# EasyEDA Pro project ProPrj_遥控板子_2025-03-31.epro

# Schematic Schematic1

## Sheets
1 P1: Board Name: Board1; Create Date: 2024-12-14; Page Name: P1; Project Name: 遥控板子; Schematic Name: Schematic1; Update Date: 2024-12-17; Company: 嘉立创EDA; Page Size: A4; Version: V1.0
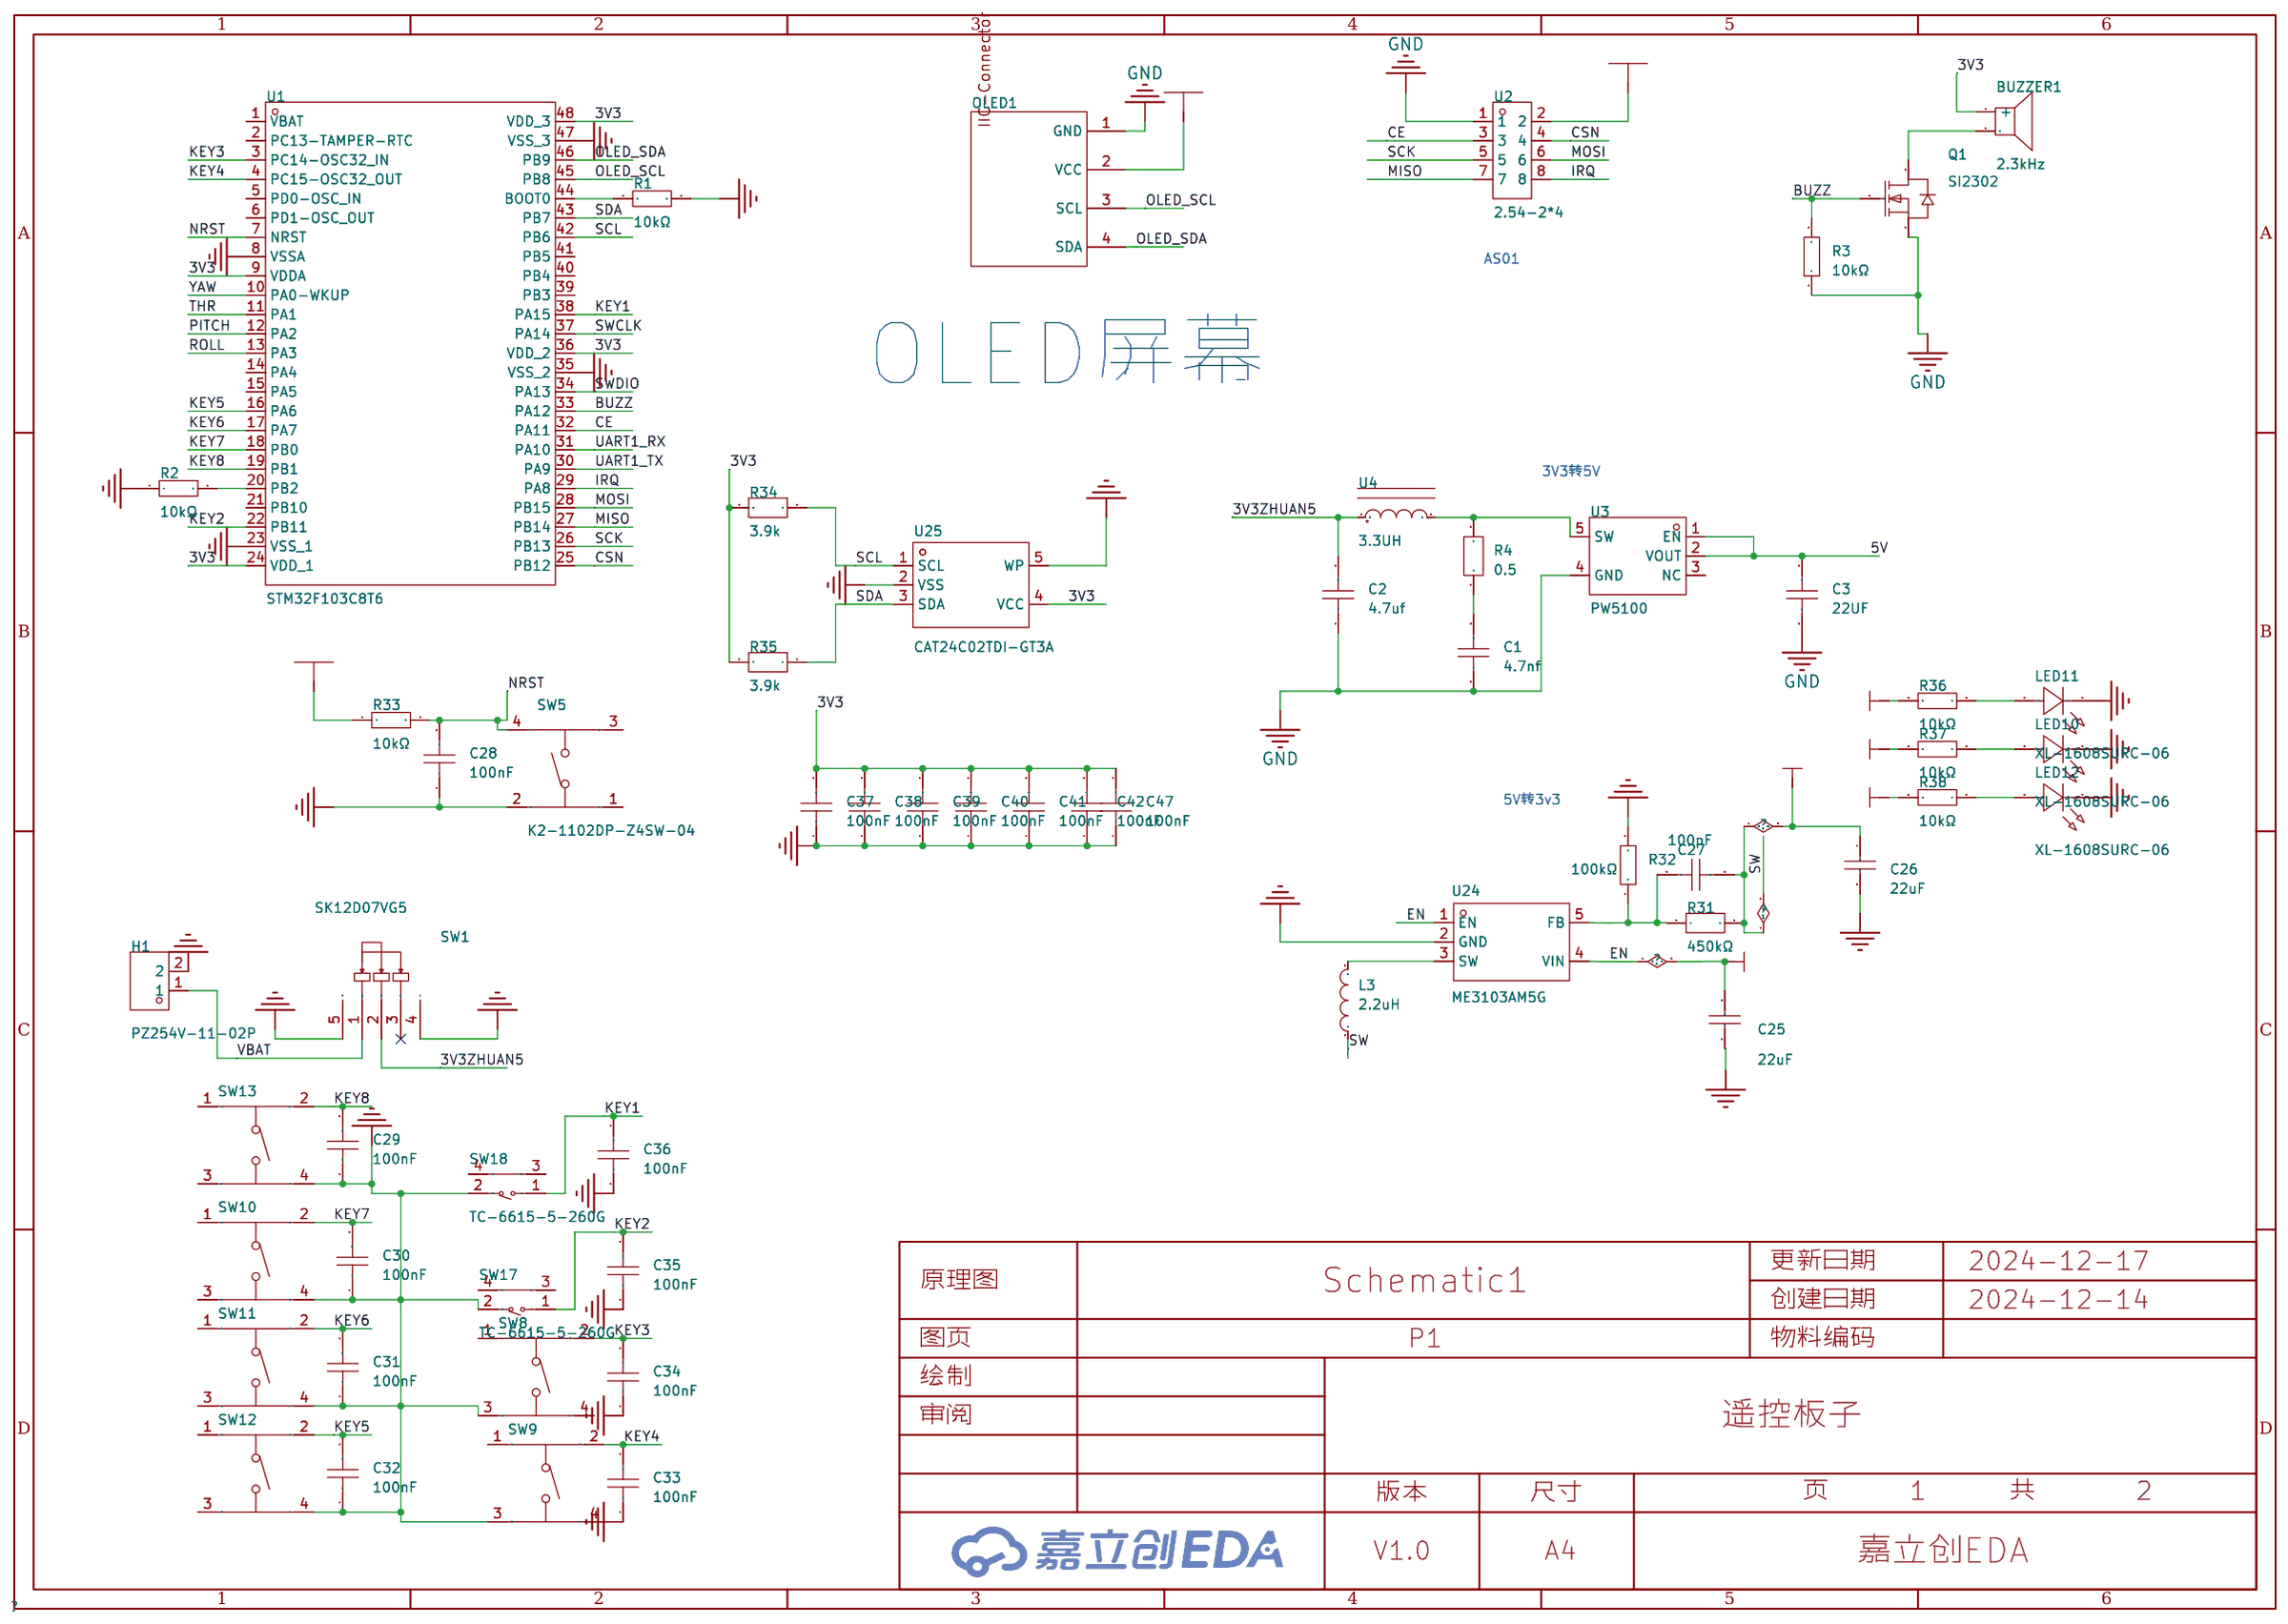
[diagram p0: P1]
2 P2: Create Date: 2024-12-16; Page Name: P2; Update Date: 2024-12-16
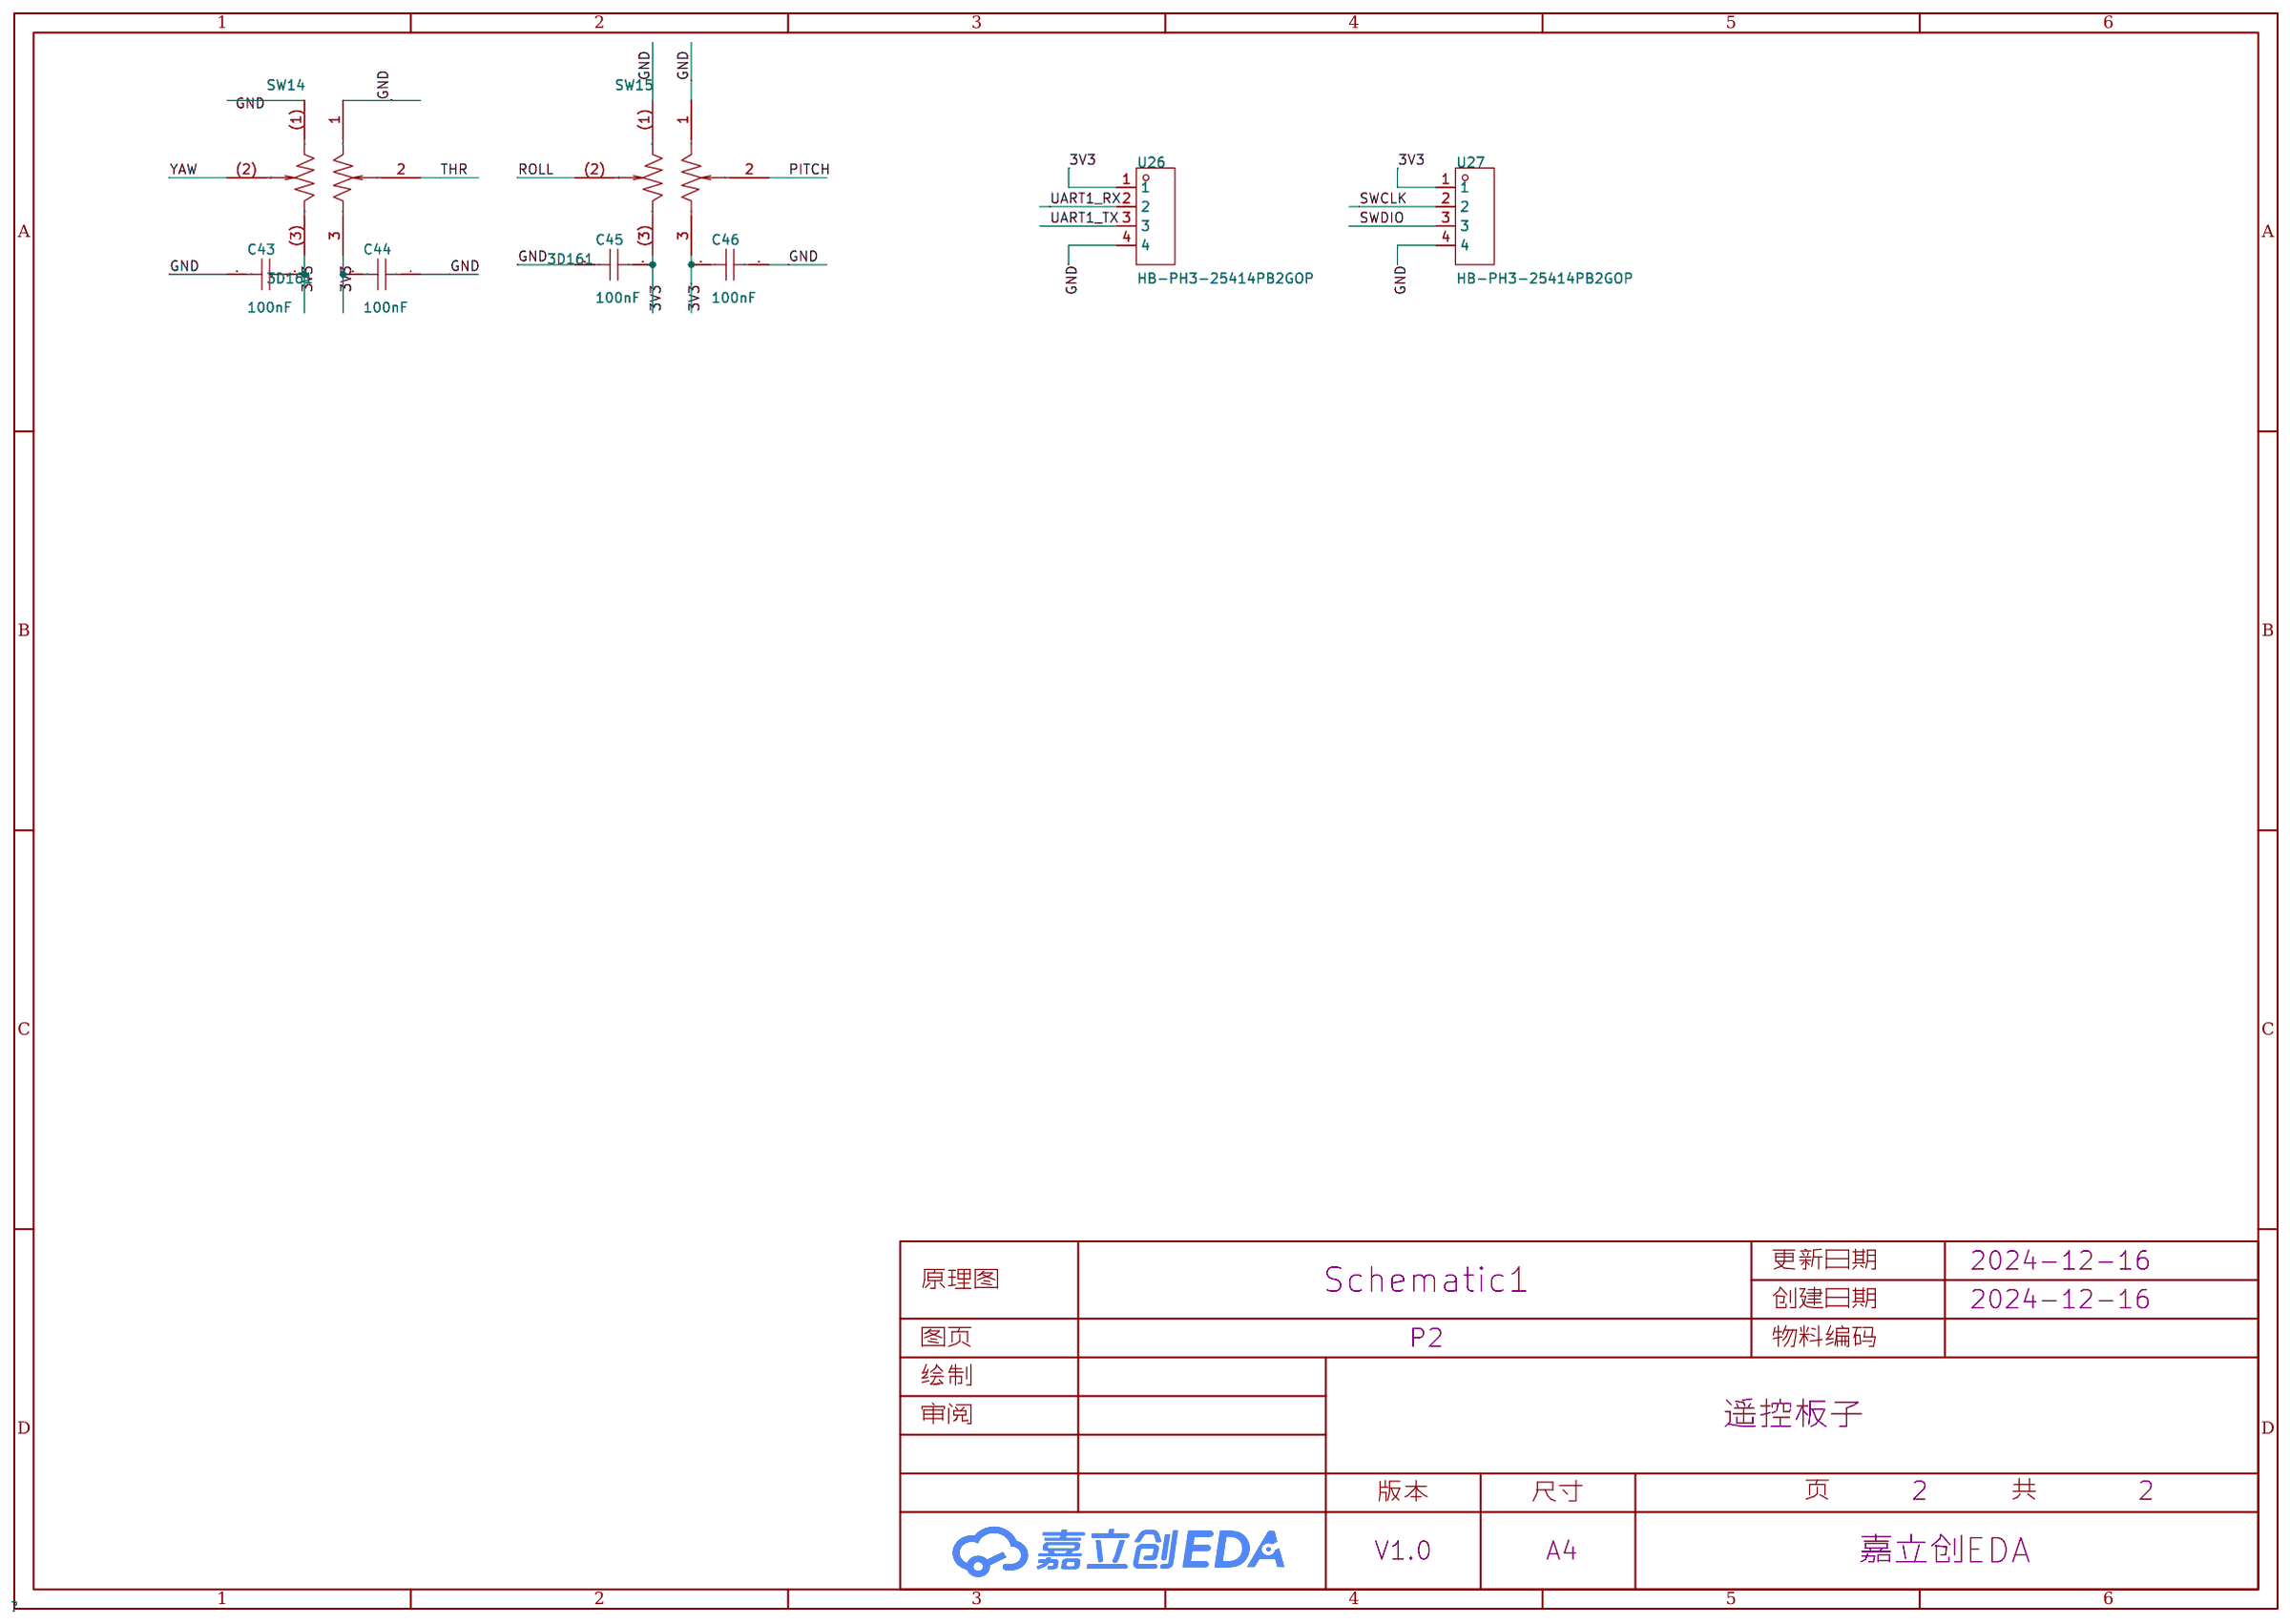
[diagram p1: P2]

## Parts
sheet P1
BUZZER1  2.3kHz  [BUZ-TH_BD12.0-P7.60-D0.6-FD]
C1  4.7nf  [C0603]
C2  4.7uf  [C0603]
C3  22UF  [C1206]
C25  22uF  [C1206]
C26  22uF  [C1206]
C27  100pF  [C0603]
C28  100nF  [C0603]
C29  100nF  [C0603]
C30  100nF  [C0603]
C31  100nF  [C0603]
C32  100nF  [C0603]
C33  100nF  [C0603]
C34  100nF  [C0603]
C35  100nF  [C0603]
C36  100nF  [C0603]
C37  100nF  [C0603]
C38  100nF  [C0603]
C39  100nF  [C0603]
C40  100nF  [C0603]
C41  100nF  [C0603]
C42  100nF  [C0603]
C47  100nF  [C0603]
H1  PZ254V-11-02P  [HDR-TH_2P-P2.54-V-M]
L3  2.2uH  [IND-SMD_L2.5-W2.0_MHCD252012A]
LED10  XL-1608SURC-06  [LED0603-RD_RED]
LED11  XL-1608SURC-06  [LED0603-RD_RED]
LED12  XL-1608SURC-06  [LED0603-RD_RED]
OLED1  -  [0.96OLED_4P]
Q1  SI2302  [SOT-23-3_L2.9-W1.3-P1.90-LS2.4-BR]
R1  10kΩ  [R0805]
R2  10kΩ  [R0805]
R3  10kΩ  [R0805]
R4  0.5  [R0603]
R31  450kΩ  [R0402]
R32  100kΩ  [R0603]
R33  10kΩ  [R0805]
R34  0.5  [R0603]
R35  0.5  [R0603]
R36  10kΩ  [R0805]
R37  10kΩ  [R0805]
R38  10kΩ  [R0805]
SW1  SK12D07VG5  [SW-TH_SK12D07VG5]
SW5  K2-1102DP-Z4SW-04  [SW-TH_4P-L6.0-W6.0-P4.50-LS6.5]
SW8  K2-1102DP-Z4SW-04  [SW-TH_4P-L6.0-W6.0-P4.50-LS6.5]
SW9  K2-1102DP-Z4SW-04  [SW-TH_4P-L6.0-W6.0-P4.50-LS6.5]
SW10  K2-1102DP-Z4SW-04  [SW-TH_4P-L6.0-W6.0-P4.50-LS6.5]
SW11  K2-1102DP-Z4SW-04  [SW-TH_4P-L6.0-W6.0-P4.50-LS6.5]
SW12  K2-1102DP-Z4SW-04  [SW-TH_4P-L6.0-W6.0-P4.50-LS6.5]
SW13  K2-1102DP-Z4SW-04  [SW-TH_4P-L6.0-W6.0-P4.50-LS6.5]
SW17  TC-6615-5-260G  [SW-TH_4P-L7.5-W5.0-P4.50]
SW18  TC-6615-5-260G  [SW-TH_4P-L7.5-W5.0-P4.50]
U1  STM32F103C8T6  [LQFP-48_L7.0-W7.0-P0.50-LS9.0-BL]
U2  2.54-2*4  [HDR-TH_8P-P2.54-V-F-R2-C4-S2.54]
U3  PW5100  [SOT-23-5_L3.0-W1.7-P0.95-LS2.8-BR]
U4  4.7uH  [IND-SMD_L7.0-W6.6]
U24  ME3103AM5G  [SOT-23-5_L3.0-W1.7-P0.95-LS2.8-BR]
U25  CAT24C02TDI-GT3A  [TSOT-23-5_L2.9-W1.6-P0.95-LS2.8-BR]
sheet P2
C43  100nF  [C0603]
C44  100nF  [C0603]
C45  100nF  [C0603]
C46  100nF  [C0603]
SW14  3D161  [SW-TH_3D161]
SW15  3D161  [SW-TH_3D161]
U26  HB-PH3-25414PB2GOP  [HDR-TH_4P-P2.54-V-M]
U27  HB-PH3-25414PB2GOP  [HDR-TH_4P-P2.54-V-M]

## Library data of the parts
BUZZER1 = TMB12A03: 驱动方式:有源(内含驱动线路);构造类型:电磁式;频率:2.3kHz;声压(SPL):85dB;; Supplier Part: C96222; Manufacturer: 华能; Supplier Footprint: 插件,D=12mm; JLCPCB Part Class: 扩展库; Datasheet: https://atta.szlcsc.com/upload/public/pdf/source/20211202/CAFCFF4D10B388AA00F36865319470DA.pdf; Supplier: LCSC; Oscillator Circuit: 有源(内含驱动线路); Technology Type: 电磁式; Operating Voltage: 1.5V~4V; Sound Pressure Level (SPL): 85dB; Diameter (φD): 12mm; Height: 9.8mm
C1 C2 C28-C47 = CGA0603X7R104K500JT: 容值:100nF;精度:±10%;额定电压:50V;材质(温度系数):X7R;; LCSC Part Name: 100nF ±10% 50V; Supplier Part: C6119867; Manufacturer: HRE(芯声); Supplier Footprint: 0603; JLCPCB Part Class: 扩展库; Supplier: LCSC; Tolerance: ±10%; Voltage Rated: 50V; Temperature Coefficient: X7R
C3 = HGC1206R5106K500NSPJ: 容值:10uF;精度:±10%;额定电压:50V;材质(温度系数):X5R;; LCSC Part Name: 10uF ±10% 50V; Supplier Part: C7432781; Manufacturer: Chinocera(华瓷); Supplier Footprint: 1206; JLCPCB Part Class: 扩展库; Datasheet: https://atta.szlcsc.com/upload/public/pdf/source/20240320/FAC3FEC40A78BC5CCCE96C232A94D860.pdf; Supplier: LCSC; Tolerance: ±10%; Voltage Rated: 50V; Temperature Coefficient: X5R
C25 C26 = CL31A226KAHNNNE: 容值:22uF;精度:±10%;额定电压:25V;材质(温度系数):X5R;; LCSC Part Name: 22uF ±10% 25V; Supplier Part: C12891; Manufacturer: SAMSUNG(三星); Supplier Footprint: 1206; JLCPCB Part Class: 基础库; Datasheet: https://atta.szlcsc.com/upload/public/pdf/source/20160218/1457707763339.pdf; Supplier: LCSC; Tolerance: ±10%; Voltage Rated: 25V; Temperature Coefficient: X5R
C27 = CC0603JRNPO9BN101: 容值:100pF;精度:±5%;额定电压:50V;材质(温度系数):NP0;; LCSC Part Name: 100pF ±5% 50V; Supplier Part: C14665; Manufacturer: YAGEO(国巨); Supplier Footprint: 0603; JLCPCB Part Class: 扩展库; Datasheet: https://atta.szlcsc.com/upload/public/pdf/source/20181008/C309499_21CC21451B82C39E3D92150FD6B30293.pdf; Supplier: LCSC; Tolerance: ±5%; Voltage Rated: 50V; Temperature Coefficient: NP0
H1 = PZ254V-11-02P: 插针结构:1x2P;间距:2.54mm;行距:-;圆针/方针:方针;安装类型:直插;排数:单排;总PIN位数:2P;额定电流:-;额定电压:-;配合针长度:6mm;塑高:2.5mm;端接针长度:3mm;触头材质:黄铜;触头镀层:-;工作温度范围:-40℃~+105℃;颜色:黑色;; LCSC Part Name: 间距:2.54mm 1x2P 直插 方针; Supplier Part: C492401; Manufacturer: XFCN(兴飞); Supplier Footprint: 插件,P=2.54mm; JLCPCB Part Class: 扩展库; Datasheet: https://atta.szlcsc.com/upload/public/pdf/source/20200309/C492401_A812433581A9B211A7FFA413ADDFF0E5.pdf; Supplier: LCSC; Pin Structure: 1x2P; Pitch: 2.54mm; Circluar Pins/Square Pins: 方针; Mounting Type: 直插; Number of Rows: 单排; Number of Pins: 2P; Length of Mating Pin: 6mm; Insulation Height: 2.5mm; Length of End Connection Pin: 3mm; Contact Material: 黄铜; Operating Temperature Range: -40℃~+105℃; Color: 黑色
L3 = BDCD002520102R2MS1: 电感值:2.2uH;精度:±20%;额定电流:1.4A;饱和电流(Isat):2.6A;; LCSC Part Name: 2.2uH ±20% 2.6A; Supplier Part: C2838385; Manufacturer: chilisin(奇力新); Supplier Footprint: 1008; JLCPCB Part Class: 扩展库; Datasheet: https://atta.szlcsc.com/upload/public/pdf/source/20210908/A593167DE07B217A909851FD79DFB804.pdf; Supplier: LCSC; Tolerance: ±20%; Rated Current: 1.4A; Saturation Current (Isat): 2.6A; DC Resistance (DCR): 130mΩ
LED10-LED12 = XL-1608SURC-06: 发光颜色:红色;功率:55mW;正向电流:25mA;主波长:617nm~621nm;透镜颜色:无色透明透镜;色温:-;发光角度:120°;载带方式:正贴;工作温度:-30℃~+85℃;; Supplier Part: C965799; Manufacturer: XINGLIGHT(成兴光); Supplier Footprint: 0603; JLCPCB Part Class: 扩展库; Datasheet: https://atta.szlcsc.com/upload/public/pdf/source/20221102/D860AFDD1CDB02C5A8064103A32707E2.pdf; Supplier: LCSC; Emitted Color: 红色; Power Dissipation: 55mW; Forward Current: 25mA; Dominant Wavelength: 617nm~621nm; Peak Wavelength: 623nm; Lens Color: 无色透明透镜; Viewing Angle: 120°; Mounting Sytle: 正贴; Operating Temperature: -30℃~+85℃
OLED1 = 0.96OLED_4P: LCSC Part Name: 0.96OLED_4P_MODULE_JX; Supplier Part: C9900004566; Manufacturer Part: 0.96OLED_4P_MODULE_JX; Supplier Footprint: THrough hole; JLCPCB Part Class: Extended Part; Supplier: LCSC
Q1 = SI2302_C2891732: 类型:1个N沟道;漏源电压(Vdss):20V;连续漏极电流(Id):3A;导通电阻(RDS(on)@Vgs,Id):50mΩ@4.5V,3A;功率(Pd):1W;阈值电压(Vgs(th)@Id):1V@250uA;; LCSC Part Name: N沟道,电流:3A,耐压:20V; Supplier Part: C2891732; Manufacturer: YONGYUTAI(永裕泰); Supplier Footprint: SOT-23; JLCPCB Part Class: 扩展库; Datasheet: https://atta.szlcsc.com/upload/public/pdf/source/20210901/467BBA277A18343FF82D7D641AA41F7C.pdf; Supplier: LCSC; Type: 1个N沟道; Drain Source Voltage (Vdss): 20V; Continuous Drain Current (Id): 3A; Drain Source On Resistance (RDS(on)@Vgs,Id): 50mΩ@4.5V,3A; Power Dissipation (Pd): 1W; Gate Threshold Voltage (Vgs(th)@Id): 1V@250uA; Total Gate Charge (Qg@Vgs): 60nC@4.5V; Input Capacitance (Ciss@Vds): 300pF@10V; Reverse Transfer Capacitance (Crss@Vds): 80pF@10V; Operating Temperature: -55℃~+150℃
R1-R3 R33 R36-R38 = 0805W8J0103T5E: 电阻类型:厚膜电阻;阻值:10kΩ;精度:±5%;功率:125mW;最大工作电压:150V;温度系数:±100ppm/℃;; LCSC Part Name: 10kΩ ±5% 125mW 厚膜电阻; Supplier Part: C25612; Manufacturer: UNI-ROYAL(厚声); Supplier Footprint: 0805; JLCPCB Part Class: 扩展库; Datasheet: https://atta.szlcsc.com/upload/public/pdf/source/20200306/C422600_1E6D84923E4A46A82E41ADD87F860B5C.pdf; Supplier: LCSC; Type: 厚膜电阻; Tolerance: ±5%; Power(Watts): 125mW; Overload Voltage (Max): 150V; Temperature Coefficient: ±100ppm/℃; Operating Temperature Range: -55℃~+155℃
R4 R34 R35 = FRC0603J103TS: 电阻类型:厚膜电阻;阻值:10kΩ;精度:±5%;功率:100mW;最大工作电压:75V;温度系数:±100ppm/℃;; LCSC Part Name: 10kΩ ±5% 100mW 厚膜电阻; Supplier Part: C2930027; Manufacturer: FOJAN(富捷); Supplier Footprint: 0603; JLCPCB Part Class: 扩展库; Datasheet: https://atta.szlcsc.com/upload/public/pdf/source/20211221/925EC7D7225764EE0046F22065062C87.pdf; Supplier: LCSC; Type: 厚膜电阻; Tolerance: ±5%; Power(Watts): 100mW; Overload Voltage (Max): 75V; Temperature Coefficient: ±100ppm/℃; Operating Temperature Range: -55℃~+155℃
R31 = FRC0402F4503TS: 电阻类型:厚膜电阻;阻值:450kΩ;精度:±1%;功率:62.5mW;最大工作电压:50V;温度系数:±100ppm/℃;; LCSC Part Name: 450kΩ ±1% 62.5mW 厚膜电阻; Supplier Part: C5159688; Manufacturer: FOJAN(富捷); Supplier Footprint: 0402; JLCPCB Part Class: 扩展库; Datasheet: https://atta.szlcsc.com/upload/public/pdf/source/20211221/925EC7D7225764EE0046F22065062C87.pdf; Supplier: LCSC; Type: 厚膜电阻; Tolerance: ±1%; Power(Watts): 62.5mW; Overload Voltage (Max): 50V; Temperature Coefficient: ±100ppm/℃
R32 = 0603WAF1003T5E: 电阻类型:厚膜电阻;阻值:100kΩ;精度:±1%;功率:100mW;最大工作电压:75V;温度系数:±100ppm/℃;; LCSC Part Name: 100kΩ ±1% 100mW 厚膜电阻; Supplier Part: C25803; Manufacturer: UNI-ROYAL(厚声); Supplier Footprint: 0603; JLCPCB Part Class: 基础库; Datasheet: https://atta.szlcsc.com/upload/public/pdf/source/20200306/C422600_1E6D84923E4A46A82E41ADD87F860B5C.pdf; Supplier: LCSC; Type: 厚膜电阻; Tolerance: ±1%; Power(Watts): 100mW; Overload Voltage (Max): 75V; Temperature Coefficient: ±100ppm/℃; Operating Temperature Range: -55℃~+155℃
SW1 = SK12D07VG5: 电路结构:单刀双掷;安装方式:侧插;开关颜色:-;额定电流(DC):500mA;额定电压(DC):50V;额定电流(AC):-;额定电压(AC):-;机械寿命:5千次;; LCSC Part Name: 两档位卧式拨动开关,柄长5MM; Supplier Part: C431548; Manufacturer: SHOU HAN(首韩); Supplier Footprint: 插件; JLCPCB Part Class: 扩展库; Datasheet: https://atta.szlcsc.com/upload/public/pdf/source/20190925/C431548_D6571AEBDE139FDB1E6F8A4B1513A630.pdf; Supplier: LCSC; Circuit: 单刀双掷; Pin Style: PC引脚; Switch Length: 8.7mm; Switch Width: 4.4mm; Switch Height: 4.7mm; Mounting Style: 侧插; Current Rating (DC): 500mA; Voltage Rating (DC): 50V; Mechanical Life: 5千次; Operating Temperature: -10℃~+50℃
SW5 SW8-SW13 = K2-1102DP-Z4SW-04: Supplier: LCSC; Supplier Part: C194449; Manufacturer: 韩国韩荣; JLCPCB Part Class: Extended Part
SW17 SW18 = TC-6615-5-260G: 电路结构:单刀单掷;按钮形状:-;作用力:260gf;安装方式:卧插;开关长度:6mm;开关宽度:6mm;开关高度:5mm;带支架:带支架;触点电流:50mA;额定电压(AC):-;额定电压(DC):12V;额定功率:-;绝缘电阻:-;带灯:-;机械寿命:-;; LCSC Part Name: 轻触6*6*5支架 插件260g; Supplier Part: C2845270; Manufacturer: HCTL(华灿天禄); Supplier Footprint: 插件; JLCPCB Part Class: 扩展库; Datasheet: https://atta.szlcsc.com/upload/public/pdf/source/20230523/3B07ECEFF69432C539FEAF1B55455C52.pdf; Supplier: LCSC; Circuit: 单刀单掷; Operating Force: 260gf; Mounting Style: 卧插; Switch Length: 6mm; Switch Width: 6mm; Switch Height: 5mm; Strike Gundam: 带支架; Contact Current: 50mA; Voltage Rating (DC): 12V
U1 = STM32F103C8T6: CPU内核:ARM-M3;CPU最大主频:72MHz;应用领域:-;; LCSC Part Name: 主流增强型ARM Cortex-M3 MCU，具有64 KB Flash、72 MHz CPU、电机控制、USB和CAN; Supplier Part: C8734; Manufacturer: ST(意法半导体); Supplier Footprint: LQFP-48(7x7); JLCPCB Part Class: 扩展库; Datasheet: https://atta.szlcsc.com/upload/public/pdf/source/20220812/8363ACEC51AD55ECEB84799464F7CB85.pdf; Supplier: LCSC; CPU Core: ARM-M3; CPU Maximum Speed: 72MHz; Program Storage Size: 64KB; Program Memory Type: FLASH; GPIO Ports Number: 37; ADC (Bit): 12bit; Low Voltage Detection Threshold: 2V~3.6V
U2 = 2.54-2*4: 插孔结构:2x4P;间距:2.54mm;行距:2.54mm;圆孔/方孔:方孔;安装类型:直插;排数:双排;总孔位数:8P;额定电流:2.5A;额定电压:-;插孔方向:顶部;塑高:8.5mm;工作温度范围:-40℃~+105℃;; LCSC Part Name: 间距:2.54mm 2x4P 直插; Supplier Part: C2977588; Manufacturer: ZHOURI(洲日); Supplier Footprint: 插件,P=2.54mm; JLCPCB Part Class: 扩展库; Datasheet: https://atta.szlcsc.com/upload/public/pdf/source/20220328/363EB391BC0EB759CF231FC910753CBE.pdf; Supplier: LCSC; Holes Structure: 2x4P; Pitch: 2.54mm; Row Spacing: 2.54mm; Circular Hole / Square Hole: 方孔; Mounting Type: 直插; Number of Rows: 双排; Number of Holes: 8P; Current Rating (Max): 2.5A; Holes Direction: 顶部; Insulation Height: 8.5mm; Operating Temperature Range: -40℃~+105℃
U3 = SN74LVC1G14DBVR_C434069: 输入类型:施密特触发器;电源电压:1.65V~5.5V;供电电流(最大值):10uA;电路数:1;最大传播延迟(tpd):20ns@5V,15pF;; LCSC Part Name: 门极和反相器; Supplier Part: C434069; Manufacturer: UMW(友台半导体); Manufacturer Part: SN74LVC1G14DBVR; Supplier Footprint: SOT-23-5; JLCPCB Part Class: 扩展库; Datasheet: https://atta.szlcsc.com/upload/public/pdf/source/20231109/6055D1B61DE2E899F5391931885BEAFC.pdf; Supplier: LCSC; Input Type: 施密特触发器; Supply Voltage(Single): 1.65V~5.5V; Supply Current (Max): 10uA; Number of Circuits: 1; Number of Inputs: 1; Sink Current: 32mA; Source Current: 32mA; High level range (VIH): 1V~3V; Low level range (VIL): 500mV~1.9V; Max Propagation Delay: 20ns@5V,15pF; Series: 74LVC系列; Operating Temperature: -40℃~+105℃
U4 = XR0630-4R7M: 电感值:4.7uH;精度:±20%;额定电流:6A;饱和电流(Isat):9A;类型:一体成型电感;; LCSC Part Name: 4.7uH ±20% 9A; Supplier Part: C5307631; Manufacturer: XR(祥如); Supplier Footprint: SMD,0630; JLCPCB Part Class: 扩展库; Datasheet: https://atta.szlcsc.com/upload/public/pdf/source/20240328/397AA2E834BC9A57C7D63D214BC3A667.pdf; Supplier: LCSC; Tolerance: ±20%; Rated Current: 6A; Saturation Current (Isat): 9A; DC Resistance (DCR): 33mΩ; Type: 一体成型电感
U24 = ME3103AM5G: 功能类型:降压型;输入电压:2.5V~5.5V;输出电压:600mV~5.5V;输出电流(最大值):1A;; Supplier Part: C236734; Manufacturer: MICRONE(南京微盟); Supplier Footprint: SOT-23-5; JLCPCB Part Class: 扩展库; Datasheet: https://atta.szlcsc.com/upload/public/pdf/source/20180709/C236734_1C8BBF9BA334136D9FAF85020467E81B.pdf; Supplier: LCSC; Function: 降压型; Input Voltage: 2.5V~5.5V; Output Voltage: 600mV~5.5V; Output Current (Max): 1A; Switching Frequency: 1.5MHz; Synchronous Rectification: 是; Number of Outputs: 1; Topology: 降压式; Switch tube (built-in/external): 内置
U25 = CAT24C02TDI-GT3A: 接口类型:I2C;存储容量:2Kbit;; Supplier Part: C81340; Manufacturer: onsemi(安森美); Supplier Footprint: TSOT-23-5; JLCPCB Part Class: 扩展库; Datasheet: https://atta.szlcsc.com/upload/public/pdf/source/20180125/C146748_15168615745961301686.pdf; Supplier: LCSC; Interface Type: I2C; Memory Size: 2Kbit; Supply Voltage: 1.7V~5.5V; Write Cycle Time (Tw): 5ms; Data Retention - TDR (Year): 100年; Write Cycle Endurance: 1000000次; Operating Temperature: -40℃~+85℃
SW14 SW15 = 3D161: 摇杆  多向; LCSC Part Name: 3D161  3D摇杆 自恢复; Supplier Part: C92593; Manufacturer: 韩国韩荣; Supplier Footprint: 插件,16x16mm; JLCPCB Part Class: 扩展库; Datasheet: https://atta.szlcsc.com/upload/public/pdf/source/20170523/1495534045704.pdf; Supplier: LCSC
U26 U27 = HB-PH3-25414PB2GOP: 插针结构:1x4P;间距:2.54mm;行距:2.54mm;圆针/方针:方针;安装类型:直插;排数:单排;总PIN位数:4P;额定电流:3A;额定电压:250V;配合针长度:6mm;塑高:2.54mm;端接针长度:3mm;触头材质:黄铜;触头镀层:金;工作温度范围:-40℃~+105℃;焊接温度(最大值):260℃;颜色:黑色;; LCSC Part Name: 间距:2.54mm 1x4P 直插 方针; Supplier Part: C6332197; Manufacturer: HANBO(汉博); Supplier Footprint: 插件,P=2.54mm; JLCPCB Part Class: 扩展库; Datasheet: https://atta.szlcsc.com/upload/public/pdf/source/20230803/F72D259687963761DF1B552F3BB84A31.pdf; Supplier: LCSC; Pin Structure: 1x4P; Pitch: 2.54mm; Row Spacing: 2.54mm; Circluar Pins/Square Pins: 方针; Mounting Type: 直插; Number of Rows: 单排; Number of Pins: 4P; Current Rating (Max): 3A; Voltage Rating (Max): 250V; Length of Mating Pin: 6mm; Insulation Height: 2.54mm; Length of End Connection Pin: 3mm; Contact Material: 黄铜; Contact Plating: 金; Operating Temperature Range: -40℃~+105℃; Soldering Temperature(Max): 260℃; Color: 黑色

## Nets
3V3: BUZZER1.1(+) C26.1 C27.2 C37.2 C38.2 C39.2 C40.2 C41.2 C42.2 C43.1 C44.2 C45.1 C46.2 C47.2 L3.1 OLED1.2(VCC) R31.2 R33.1 R34.2 R35.2 R36.2 SW14.3 SW14.(3) SW15.3 SW15.(3) U1.9(VDDA) U1.24(VDD_1) U1.36(VDD_2) U1.48(VDD_3) U2.2 U25.4(VCC) U26.1 U27.1
3V3ZHUAN5: C2.2 SW1.2 U4.1(S)
5V: C3.2 C25.2 R37.2 U3.1(EN) U3.2(VOUT) U24.1(EN) U24.4(VIN)
GND: C1.1 C2.1 C3.1 C25.1 C26.2 C28.1 C29.1 C30.1 C31.1 C32.1 C33.1 C34.1 C35.1 C36.1 C37.1 C38.1 C39.1 C40.1 C41.1 C42.1 C43.2 C44.1 C45.2 C46.1 C47.1 H1.2 LED10.1(K) LED11.1(K) LED12.1(K) OLED1.1(GND) Q1.2(S) R1.2 R2.1 R3.1 R32.2 SW1.4 SW1.5 SW5.2 SW8.3 SW9.3 SW10.4 SW11.4 SW12.4 SW13.4 SW14.1 SW14.(1) SW15.1 SW15.(1) SW17.2 SW18.2 U1.8(VSSA) U1.23(VSS_1) U1.35(VSS_2) U1.47(VSS_3) U2.1 U3.4(GND) U24.2(GND) U25.2(VSS) U25.5(WP) U26.4 U27.4
VBAT: H1.1 R38.2 SW1.1
BUZZ: Q1.1(G) R3.2 U1.33(PA12)
CE: U1.32(PA11) U2.3
CSN: U1.25(PB12) U2.4
IRQ: U1.29(PA8) U2.8
KEY1: C36.2 SW18.1 U1.38(PA15)
KEY2: C35.2 SW17.1 U1.22(PB11)
KEY3: C34.2 SW8.2 U1.3(PC14-OSC32_IN)
KEY4: C33.2 SW9.2 U1.4(PC15-OSC32_OUT)
KEY5: C32.2 SW12.2 U1.16(PA6)
KEY6: C31.2 SW11.2 U1.17(PA7)
KEY7: C30.2 SW10.2 U1.18(PB0)
KEY8: C29.2 SW13.2 U1.19(PB1)
MISO: U1.27(PB14) U2.7
MOSI: U1.28(PB15) U2.6
NRST: C28.2 R33.2 SW5.4 U1.7(NRST)
OLED_SCL: OLED1.3(SCL) U1.45(PB8)
OLED_SDA: OLED1.4(SDA) U1.46(PB9)
PITCH: SW15.2 U1.12(PA2)
ROLL: SW15.(2) U1.13(PA3)
SCK: U1.26(PB13) U2.5
SCL: R34.1 U1.42(PB6) U25.1(SCL)
SDA: R35.1 U1.43(PB7) U25.3(SDA)
SWCLK: U1.37(PA14) U27.2
SWDIO: U1.34(PA13) U27.3
THR: SW14.2 U1.11(PA1)
UART1_RX: U1.31(PA10) U26.2
UART1_TX: U1.30(PA9) U26.3
YAW: SW14.(2) U1.10(PA0-WKUP)
$1N642: R1.1 U1.44(BOOT0)
$1N784: R2.2 U1.20(PB2)
$1N1218: BUZZER1.2 Q1.3(D)
$1N2158: R4.2 U3.5(SW) U4.2(F)
$1N2242: C1.2 R4.1
$1N8518: LED11.2(A) R36.1
$1N8561: LED10.2(A) R37.1
$1N8604: LED12.2(A) R38.1
Net-(C27-1): C27.1 R32.1 U24.5(FB)

Not connected (* = marked no-connect by the designer): L3 2; R31 1; SW1 3*; SW5 1 3; SW8 1 4; SW9 1 4; SW10 1 3; SW11 1 3; SW12 1 3; SW13 1 3; SW17 3 4; SW18 3 4; U1 1(VBAT) 2(PC13-TAMPER-RTC) 5(PD0-OSC_IN) 6(PD1-OSC_OUT) 14(PA4) 15(PA5) 21(PB10) 39(PB3) 40(PB4) 41(PB5); U3 3(NC); U24 3(SW)

## Notes on the sheets
sheet 1
- AS01
- OLED屏幕
- 3V3转5V
- 5V转3v3

# Board PCB1
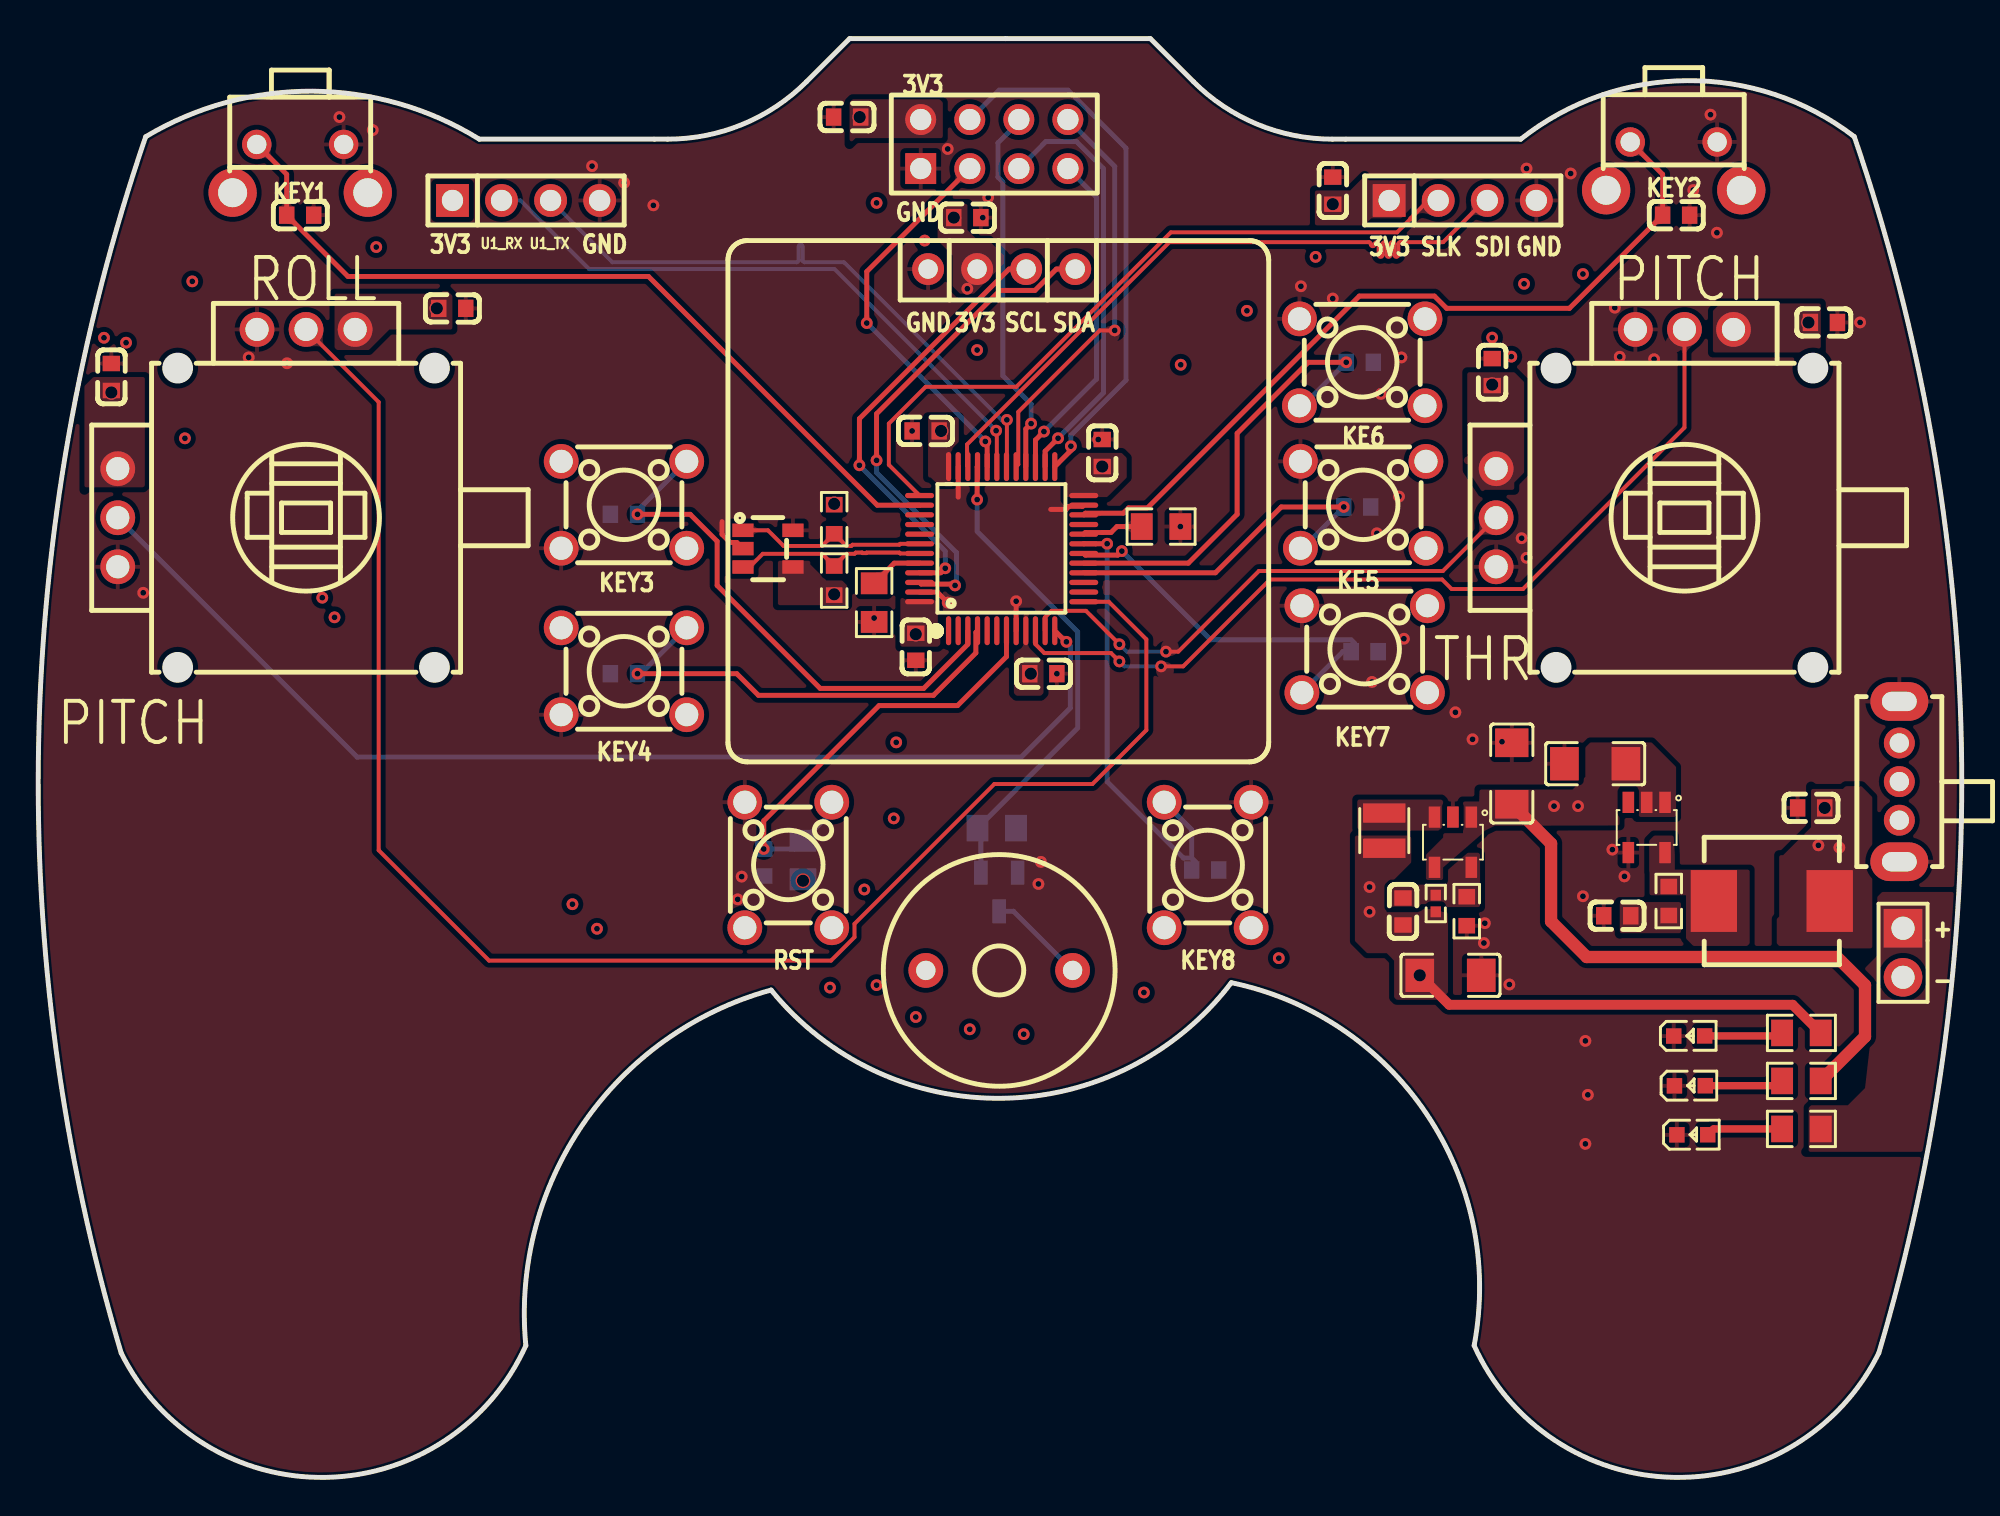
[diagram p2: board, top side]
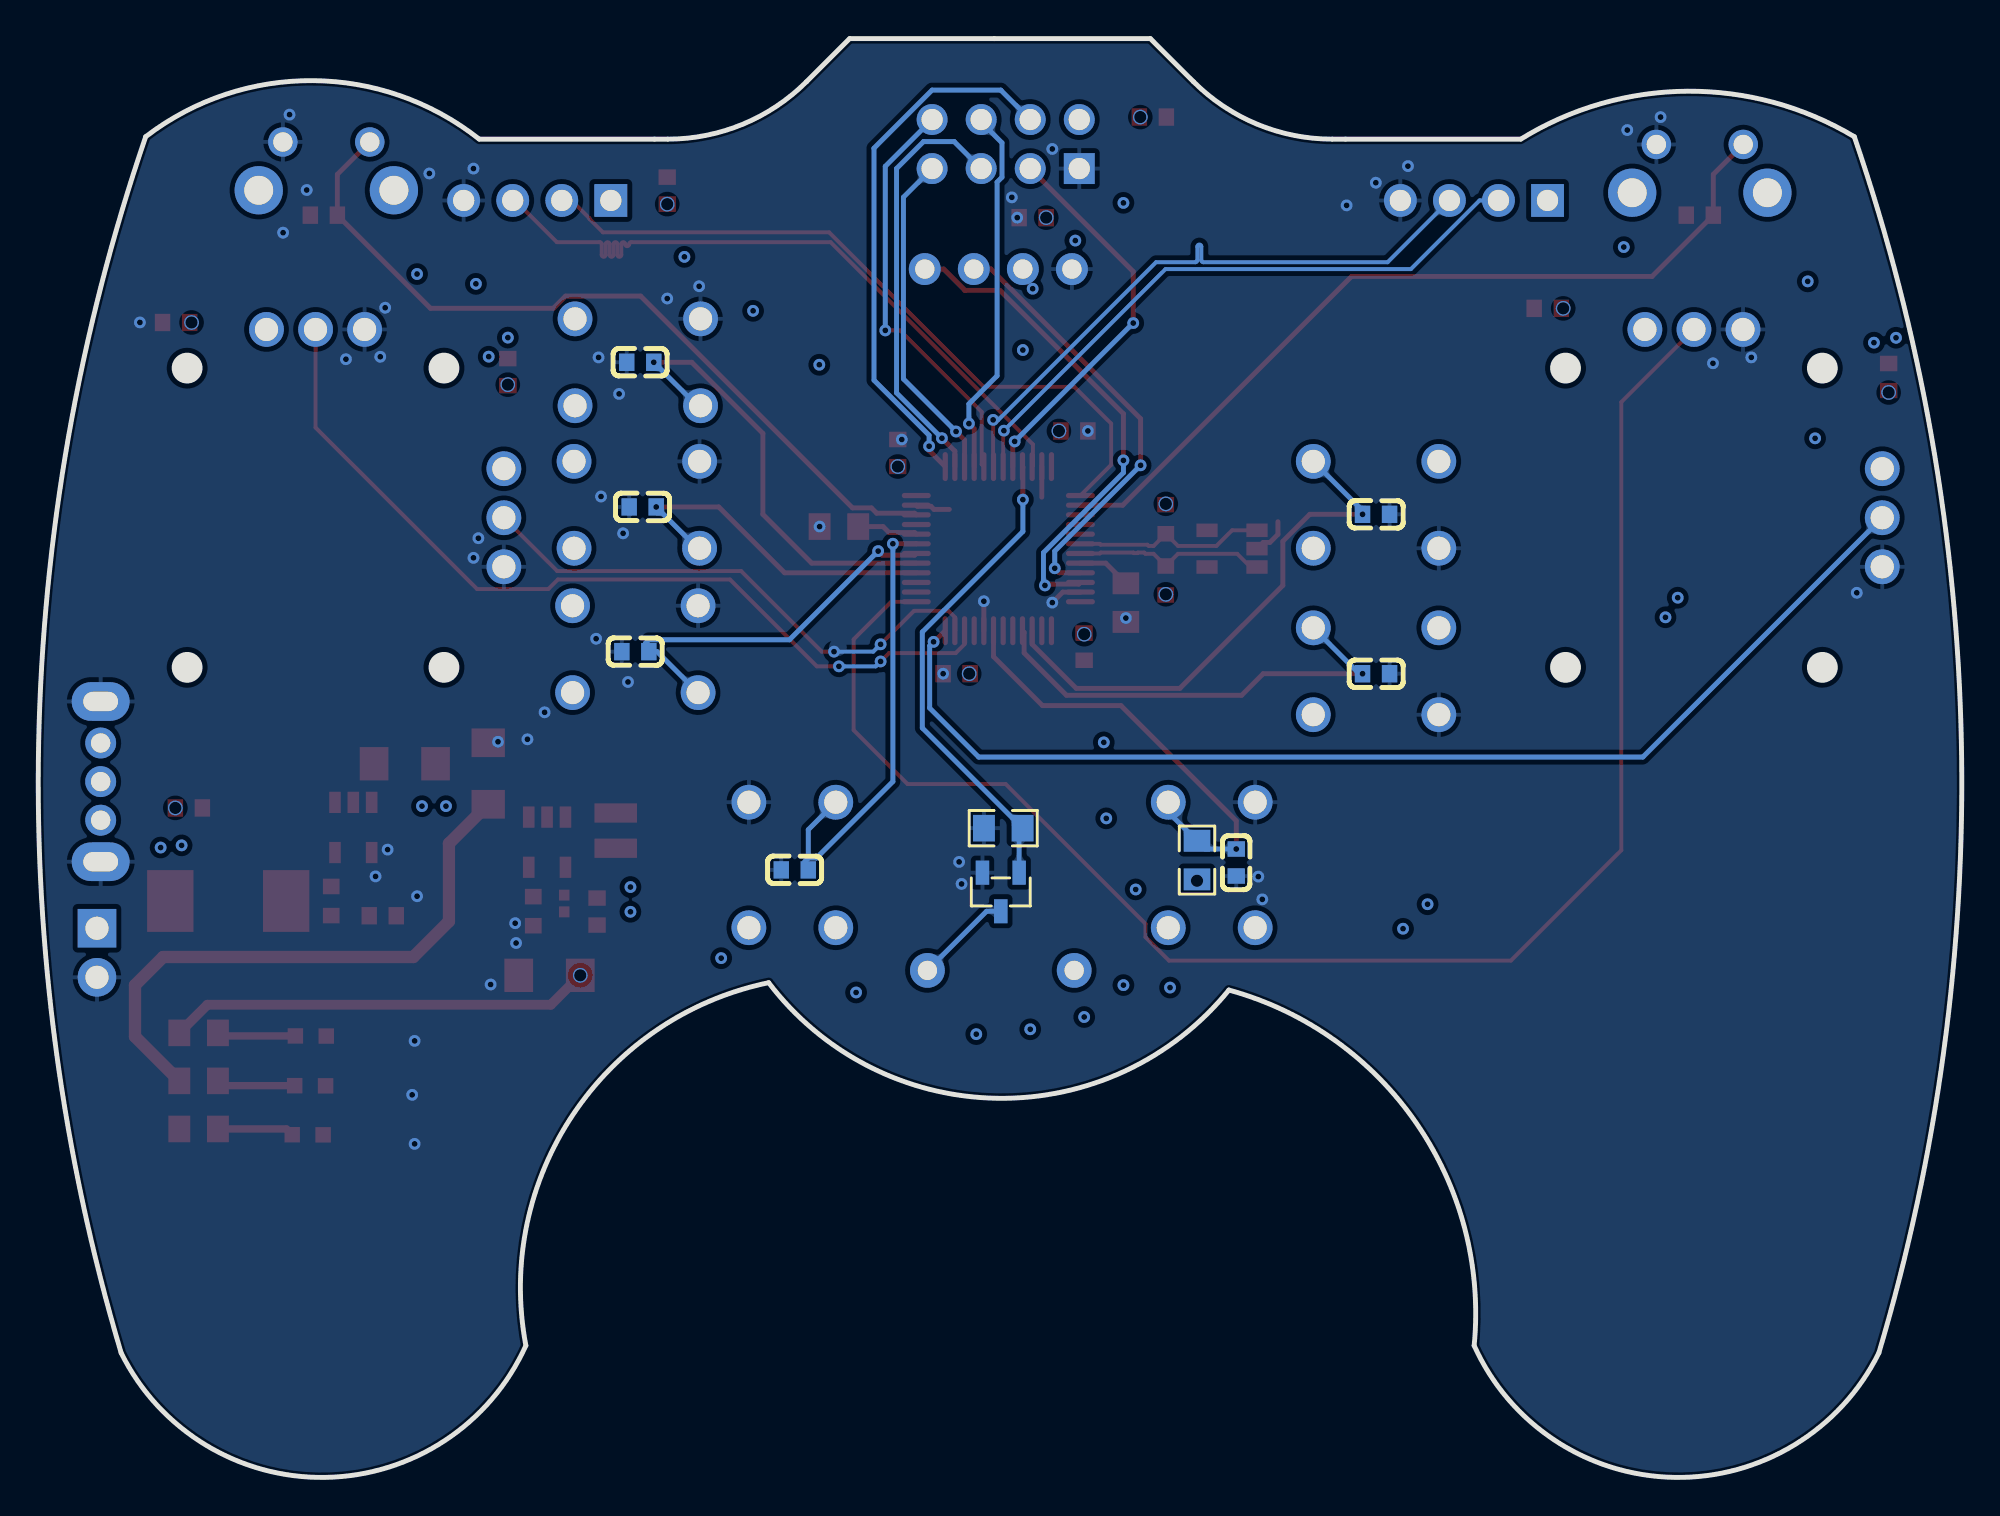
[diagram p3: board, bottom side, seen from below]

Outline 99.56 x 74.52 mm; copper layers: Top Layer, Inner1, Inner2, Bottom Layer. Coordinates in mm from the lower left corner of the outline.
Outline path: 4.27,6.45 arc(0,38.04) 5.54,69.44 arc(14.2,71.79) 22.82,69.31 32.58,69.31 arc(36.47,70.08) 39.76,72.29 41.99,74.52 57.57,74.52 59.8,72.29 arc(63.09,70.08) 66.98,69.31 76.75,69.31 arc(85.36,72.34) 94.02,69.44 arc(99.56,38.04) 95.29,6.45 arc(84.69,0) 74.33,6.83 arc(71.89,18.79) 61.76,25.62 arc(49.94,19.63) 37.93,25.24 arc(28.22,18.35) 25.23,6.83 arc(14.87,0) 4.27,6.45
Stack: Top Layer 0.035mm 外层铜厚1oz / Dielectric1 0.2104mm 7628 RC49% 8.6mil / Inner1 0.0152mm 内层铜厚 / Dielectric2 1.065mm 1.1mm H/HOZ Copper / Inner2 0.0152mm 内层铜厚 / Dielectric3 0.2104mm 7628 RC49% 8.6mil / Bottom Layer 0.035mm 外层铜厚1oz

## Design rules (mm)
net SCL: DP1
net SDA: DP1
template: 自定义配置
spacing copperThickness1oz (default): track to track 0.102, other pairs 0.152 to 0.3
spacing copperThickness2oz: track to track 0.203, other pairs 0.152 to 0.3
track width copperThickness1oz (default): min 0.127, default 0.254, max 2.54
track width copperThickness2oz: min 0.203, default 0.254, max 2.54
differential pair differentialPair (default): width min 0.127, default 0.254, max 2.54; gap min 0.152, default 0.152
via viaSize (default): diameter min 0.5, default 0.61, max 10; hole min 0.3, default 0.305, max 6.3
net 3V3 uses sad
net VBAT uses sad
net 3V3ZHUAN5 uses sad
net $1N2242 uses sad
net 5V uses sad
net $1N2894 uses sad
net $1N2893 uses sad
net $1N2158 uses sad

## Placement (name value [footprint] x y rotation side)
BUZZER1  2.3kHz  [BUZ-TH_BD12.0-P7.60-D0.6-FD]  49.74 26.26 0 top
C1  4.7nf  [C0603]  81.74 29.09 0 top
C2  4.7uf  [C0603]  91.78 34.67 0 top
C3  22UF  [C1206]  80.6 36.96 0 top
C25  22uF  [C1206]  76.28 36.45 270 top
C26  22uF  [C1206]  73.11 26 0 top
C27  100pF  [C0603]  70.65 29.31 270 top
C28  100nF  [C0603]  37.55 31.85 90 bottom
C29  100nF  [C0603]  60.41 31.46 180 bottom
C30  100nF  [C0603]  68.66 42.77 180 bottom
C31  100nF  [C0603]  68.41 57.75 180 bottom
C32  100nF  [C0603]  68.28 50.26 180 bottom
C33  100nF  [C0603]  30.31 41.62 0 bottom
C34  100nF  [C0603]  30.31 49.88 0 bottom
C35  100nF  [C0603]  84.79 65.37 180 top
C36  100nF  [C0603]  13.54 65.37 180 top
C37  100nF  [C0603]  45.42 43.02 90 top
C38  100nF  [C0603]  55.07 53.05 270 top
C39  100nF  [C0603]  45.93 54.2 0 top
C40  100nF  [C0603]  41.87 70.45 0 top
C41  100nF  [C0603]  52.03 41.62 180 top
C42  100nF  [C0603]  48.09 65.25 180 top
C43  100nF  [C0603]  92.44 59.82 0 top
C44  100nF  [C0603]  3.77 56.99 270 top
C45  100nF  [C0603]  75.27 57.25 90 top
C46  100nF  [C0603]  21.42 60.55 180 top
C47  100nF  [C0603]  67.01 66.64 270 top
H1  PZ254V-11-02P  [HDR-TH_2P-P2.54-V-M]  96.54 27.17 270 top
L3  2.2uH  [IND-SMD_L2.5-W2.0_MHCD252012A]  69.68 33.5 270 top
LED10  XL-1608SURC-06  [LED0603-RD_RED]  85.5 20.28 0 top
LED11  XL-1608SURC-06  [LED0603-RD_RED]  85.47 22.86 0 top
LED12  XL-1608SURC-06  [LED0603-RD_RED]  85.63 17.74 0 top
OLED1  -  [0.96OLED_4P]  49.87 62.58 0 top
Q1  SI2302  [SOT-23-3_L2.9-W1.3-P1.90-LS2.4-BR]  49.74 30.32 90 bottom
R1  10kΩ  [R0805]  43.26 45.31 270 top
R2  10kΩ  [R0805]  58.12 49.24 180 top
R3  10kΩ  [R0805]  49.61 33.62 180 bottom
R4  0.5  [R0603]  84.41 29.85 90 top
R31  450kΩ  [R0402]  72.34 29.72 270 top
R32  100kΩ  [R0603]  73.95 29.33 270 top
R33  10kΩ  [R0805]  39.58 31.97 90 bottom
R34  0.5  [R0603]  41.19 49.63 90 top
R35  0.5  [R0603]  41.19 46.45 270 top
R36  10kΩ  [R0805]  91.28 23.02 0 top
R37  10kΩ  [R0805]  91.28 20.53 0 top
R38  10kΩ  [R0805]  91.28 18.05 0 top
SW1  SK12D07VG5  [SW-TH_SK12D07VG5]  96.35 36.04 90 top
SW5  K2-1102DP-Z4SW-04  [SW-TH_4P-L6.0-W6.0-P4.50-LS6.5]  38.82 31.72 90 top
SW8  K2-1102DP-Z4SW-04  [SW-TH_4P-L6.0-W6.0-P4.50-LS6.5]  30.31 50.37 0 top
SW9  K2-1102DP-Z4SW-04  [SW-TH_4P-L6.0-W6.0-P4.50-LS6.5]  30.31 41.75 0 top
SW10  K2-1102DP-Z4SW-04  [SW-TH_4P-L6.0-W6.0-P4.50-LS6.5]  68.66 42.89 180 top
SW11  K2-1102DP-Z4SW-04  [SW-TH_4P-L6.0-W6.0-P4.50-LS6.5]  68.54 57.75 180 top
SW12  K2-1102DP-Z4SW-04  [SW-TH_4P-L6.0-W6.0-P4.50-LS6.5]  68.59 50.37 180 top
SW13  K2-1102DP-Z4SW-04  [SW-TH_4P-L6.0-W6.0-P4.50-LS6.5]  60.53 31.72 90 top
SW14  3D161  [SW-TH_3D161]  81.62 53.31 180 top
SW15  3D161  [SW-TH_3D161]  10.24 53.31 180 top
SW17  TC-6615-5-260G  [SW-TH_4P-L7.5-W5.0-P4.50]  84.66 67.91 0 top
SW18  TC-6615-5-260G  [SW-TH_4P-L7.5-W5.0-P4.50]  13.54 67.79 0 top
U1  STM32F103C8T6  [LQFP-48_L7.0-W7.0-P0.50-LS9.0-BL]  49.87 48.1 0 top
U2  2.54-2*4  [HDR-TH_8P-P2.54-V-F-R2-C4-S2.54]  49.49 69.06 0 top
U3  PW5100  [SOT-23-5_L3.0-W1.7-P0.95-LS2.8-BR]  83.27 33.66 90 top
U4  4.7uH  [IND-SMD_L7.0-W6.6]  89.74 29.85 180 top
U24  ME3103AM5G  [SOT-23-5_L3.0-W1.7-P0.95-LS2.8-BR]  73.23 32.9 90 top
U25  CAT24C02TDI-GT3A  [TSOT-23-5_L2.9-W1.6-P0.95-LS2.8-BR]  37.77 48.1 180 top
U26  HB-PH3-25414PB2GOP  [HDR-TH_4P-P2.54-V-M]  25.24 66.14 0 top
U27  HB-PH3-25414PB2GOP  [HDR-TH_4P-P2.54-V-M]  73.74 66.14 0 top

## Footprints (pads in the part's own frame, mm; a bottom-side part is the same pattern mirrored in y, then rotated)
0.96OLED_4P
  round 1.651 hole 1.001: 1(-3.81,0) 2(-1.27,0.003) 3(1.27,0.003) 4(3.81,0.003)
BUZ-TH_BD12.0-P7.60-D0.6-FD
  round 1.8 hole 1: 1(-3.8,0) 2(3.8,0)
C0603
  rect 0.8x0.9 smd: 1(-0.7,0) 2(0.7,0)
C1206
  rect 1.485x1.728 smd: 1(-1.593,0) 2(1.593,0)
HDR-TH_2P-P2.54-V-M
  rect 2x2 hole 1.2: 1(-1.27,0)
  round 2 hole 1.2: 2(1.27,0)
HDR-TH_4P-P2.54-V-M
  rect 1.7x1.7 hole 1.1: 1(-3.81,0)
  round 1.7 hole 1.1: 2(-1.27,0) 3(1.27,0) 4(3.81,0)
HDR-TH_8P-P2.54-V-F-R2-C4-S2.54
  rect 1.6x1.6 hole 1.1: 1(-3.81,-1.27)
  round 1.6 hole 1.1: 2(-3.81,1.27) 3(-1.27,-1.27) 4(-1.27,1.27) 5(1.27,-1.27) 6(1.27,1.27) 7(3.81,-1.27) 8(3.81,1.27)
IND-SMD_L2.5-W2.0_MHCD252012A
  rect 1x2.2 smd: 1(0.913,0) 2(-0.913,0)
IND-SMD_L7.0-W6.6
  rect 2.4x3.2 smd: 1(-3,0) 2(3,0)
LED0603-RD_RED
  rect 0.8x0.8 smd: 1(-0.799,-0.004) 2(0.799,0.004)
LQFP-48_L7.0-W7.0-P0.50-LS9.0-BL
  oval 0.27x1.5 smd: 1(-2.75,-4.25) 2(-2.25,-4.25) 3(-1.75,-4.25) 4(-1.25,-4.25) 5(-0.75,-4.25) 6(-0.25,-4.25) 7(0.25,-4.25) 8(0.75,-4.25) 9(1.25,-4.25) 10(1.75,-4.25) 11(2.25,-4.25) 12(2.75,-4.25) 25(2.75,4.25) 26(2.25,4.25) 27(1.75,4.25) 28(1.25,4.25) 29(0.75,4.25) 30(0.25,4.25) 31(-0.25,4.25) 32(-0.75,4.25) 33(-1.25,4.25) 34(-1.75,4.25) 35(-2.25,4.25) 36(-2.75,4.25)
  oval 1.5x0.27 smd: 13(4.25,-2.75) 14(4.25,-2.25) 15(4.25,-1.75) 16(4.25,-1.25) 17(4.25,-0.75) 18(4.25,-0.25) 19(4.25,0.25) 20(4.25,0.75) 21(4.25,1.25) 22(4.25,1.75) 23(4.25,2.25) 24(4.25,2.75) 37(-4.25,2.75) 38(-4.25,2.25) 39(-4.25,1.75) 40(-4.25,1.25) 41(-4.25,0.75) 42(-4.25,0.25) 43(-4.25,-0.25) 44(-4.25,-0.75) 45(-4.25,-1.25) 46(-4.25,-1.75) 47(-4.25,-2.25) 48(-4.25,-2.75)
R0402
  rect 0.566x0.54 smd: 1(-0.433,0) 2(0.433,0)
R0603
  rect 0.806x0.864 smd: 1(-0.753,0) 2(0.753,0)
R0805
  rect 1.133x1.377 smd: 1(-1,0) 2(1,0)
SOT-23-3_L2.9-W1.3-P1.90-LS2.4-BR
  rect 1.25x0.7 smd: 1(1,-0.95) 2(1,0.95) 3(-1,0)
SOT-23-5_L3.0-W1.7-P0.95-LS2.8-BR
  rect 1.1x0.6 smd: 1(1.3,-0.95) 2(1.3,0) 3(1.3,0.95) 4(-1.3,0.95) 5(-1.3,-0.95)
SW-TH_3D161
  round 1.8 hole 1.2: 1(6.146,6.146) 2(6.146,3.606) 3(6.146,1.065) (1)(-1.065,-6.146) (2)(-3.606,-6.146) (3)(-6.146,-6.146)
SW-TH_4P-L6.0-W6.0-P4.50-LS6.5
  round 1.8 hole 1.2: 1(-3.25,2.25) 2(3.25,2.25) 3(-3.25,-2.25) 4(3.25,-2.25)
SW-TH_4P-L7.5-W5.0-P4.50
  round 1.524 hole 1: 1(-2.25,1.25) 2(2.25,1.25)
  round 2.5 hole 1.5: 3(-3.5,-1.25) 4(3.5,-1.25)
SW-TH_SK12D07VG5
  oval 1.6x1.6 hole 1: 1(-2,0) 2(0,0) 3(2,0)
  oval 2x3 hole 1x1.8: 4(4.15,0) 5(-4.15,0)
TSOT-23-5_L2.9-W1.6-P0.95-LS2.8-BR
  rect 1.1x0.7 smd: 1(1.294,-0.951) 2(1.294,-0.001) 3(1.294,0.951) 4(-1.294,0.951) 5(-1.294,-0.949)

## Nets
As in the schematic, except:
$1N2893: L3.2 U24.3
$1N2894: C27.1 R31.1 R32.1 U24.5

Pads without a net: SW1 3; SW5 1 3; SW8 1 4; SW9 1 4; SW10 1 3; SW11 1 3; SW12 1 3; SW13 1 3; SW17 3 4; SW18 3 4; U1 1 2 5 6 14 15 21 39 40 41; U3 3

## Via types
v1: diameter 0.61, hole 0.305, Top Layer to Bottom Layer, 115 vias
v2: diameter 0.762, hole 0.635, Top Layer to Bottom Layer, 16 vias

## Routing (per net, layer and track width the routed paths; a pad name or vN(x,y) marks a point on that pad's centre or on a via; arc(x,y) is an arc through that point)
3V3: length 22
  Top Layer w0.508: R36.2 90.82,24.48 73.04,24.48 v2(71.52,26)
  vias: v1(3.38,59.02) v1(4.53,58.77) v1(7.58,53.82) v1(7.96,61.94) v1(14.69,45.56) v1(15.32,44.55) v1(17.48,63.72) v1(27.64,29.69) v1(28.91,28.42) v1(40.98,25.37) v1(42.75,30.45) v1(43.39,66.01) v1(43.39,25.5) v1(44.28,34.13) v1(44.41,38.07) v1(45.42,23.84) v1(45.88,64.06) v1(48.09,61.56) v1(48.22,23.21) v1(48.6,58.39) v1(51.01,22.96) v1(57.23,25.11) v1(59.14,57.63) v1(62.57,60.42) v1(64.22,26.89) v1(66.12,63.21) v1(68.92,30.58) v1(68.92,29.29) v1(75.26,59.03) v1(76.26,58.05) v1(76.92,61.82) v1(79.97,62.33) v2(3.77,56.19) v2(20.62,60.55) v2(39.58,30.9) v2(41.19,50.42) v2(41.19,45.74) v2(42.52,70.45) v2(45.42,43.67) v2(46.73,54.2) v2(47.39,65.25) v2(51.38,41.62) v2(55.07,52.35) v2(67.01,65.94) v2(75.27,56.6) v2(91.64,59.82)
3V3ZHUAN5:
  vias: v1(92.16,32.73) v1(93.24,32.62) v2(92.48,34.67)
5V: length 30.4
  Top Layer w0.635: C25.2 78.31,32.83 78.31,28.8 80.16,26.95 93.11,26.95 94.57,25.5 94.57,22.83 R37.2
  vias: v1(78.47,34.77) v1(79.71,34.77)
GND: length 8.6
  Top Layer w0.254: 36.47,48.1 36.15,48.42 35.81,48.42 35.39,48.84 35.39,49.5 ; v1(47.07,45.31) 46.53,45.85 U1.47 ; v1(50.62,45.38) U1.8 ; 52.41,50.13 53.2,50.13 53.36,50.29 54.06,50.29 U1.23 ; U1.35 47.62,50.77
  vias: v1(5.42,45.82) v1(10.88,58.01) v1(12.86,57.7) v1(15.58,70.45) v1(17.3,69.78) v1(28.66,67.91) v1(30.32,67.05) v1(31.83,65.88) v1(36.2,29.94) v1(36.4,31.12) v1(43.26,44.51) v1(45.23,54.2) v1(47.07,68.8) v1(48.89,65.25) v1(49.17,66.3) v1(51.77,30.74) v1(51.9,31.88) v1(52.73,41.62) v1(54.87,53.75) v1(59.12,49.24) v1(65.36,61.69) v1(67.01,61.06) v1(69.04,41.2) v1(69.3,48.9) v1(69.5,56.12) v1(70.44,50.8) v1(70.57,58.01) v1(70.69,43.44) v1(73.36,39.63) v1(74.25,38.23) v1(74.89,28.7) v1(74.84,27.68) v1(75.77,38.1) v1(76.16,25.53) v1(76.79,48.64) v1(77.04,67.79) v1(77.04,47.63) v1(79.33,67.53) v1(79.97,30.1) v1(80.09,22.61) v1(80.09,17.27) v1(80.22,19.81) v1(81.49,32.51) v1(81.62,60.58) v1(81.87,58.04) v1(82.12,31.13) v1(83.65,57.91) v1(85.68,66.68) v1(86.57,70.58) v1(86.9,64.47) v1(94.32,59.82)
BUZZ: length 25.4
  Top Layer w0.254: U1.33 48.6,52.33 v1(48.6,50.64)
  Bottom Layer w0.254: v1(48.6,50.64) 48.6,48.99 53.8,43.78 53.8,38.81 R3.2 48.79,33.45 48.79,31.32
CE: length 20.2
  Top Layer w0.254: v1(42.88,59.79) 42.88,62.45 48.22,67.79 ; U1.32 49.12,53.56 v1(49.02,53.65)
  Bottom Layer w0.254: v1(49.02,53.65) 42.89,59.79 v1(42.88,59.79)
CSN: length 28
  Top Layer w0.254: v1(53.45,53.41) 53.45,53.19 U1.25
  Bottom Layer w0.254: 48.22,70.33 49.74,71.85 53.3,71.85 56.31,68.84 56.31,56.83 53.45,53.97 v1(53.45,53.41)
IRQ: length 21.5
  Top Layer w0.203: v1(55.72,59.4) 54.95,59.4 50.73,55.19 50.73,52.46 U1.29
  Bottom Layer w0.254: v1(55.72,59.4) 55.72,67.9 U2.8
KEY1: length 43.3
  Top Layer w0.254: U1.38 43.43,50.35 31.58,62.2 16.02,62.2 C36.2 12.84,67.49 SW18.1
KEY2: length 41.4
  Top Layer w0.254: SW17.1 84.09,67.49 C35.2 79.27,60.55 72.91,60.55 72.27,61.18 68.39,61.18 57.42,50.21 56.44,50.21 56.17,49.94 54.2,49.94 U1.22
KEY3: length 27.6
  Top Layer w0.254: v1(31.01,49.88) 33.74,49.88 35.13,48.48 35.13,46.2 40.47,40.86 45.83,40.86 48.12,43.15 U1.3
  Bottom Layer w0.254: v1(31.01,49.88) 31.01,50.07 SW8.2
KEY4: length 23.6
  Top Layer w0.254: U1.4 48.53,43.77 48.53,42.7 46.34,40.51 37.27,40.51 36.15,41.62 v1(31.01,41.62)
  Bottom Layer w0.254: v1(31.01,41.62) 31.18,41.62 SW9.2
KEY5: length 18
  Top Layer w0.254: v1(67.58,50.26) 64.34,50.26 60.94,46.85 U1.16
  Bottom Layer w0.254: SW12.2 65.44,48.12 v1(67.58,50.26)
KEY6: length 23.7
  Top Layer w0.254: v1(67.71,57.75) 65.74,57.75 62.06,54.07 62.06,49.88 59.53,47.35 U1.17
  Bottom Layer w0.254: SW11.2 65.46,55.5 v1(67.71,57.75)
KEY7: length 20.1
  Top Layer w0.254: U1.18 54.2,47.77 55.88,47.77 v1(56.09,47.97)
  Bottom Layer w0.254: SW10.2 67.54,42.77 C30.2 68.14,42.95 68.14,43.2 67.96,43.38 60.68,43.38 v1(56.09,47.97)
KEY8: length 23.8
  Top Layer w0.254: v1(55.33,48.36) 54.12,48.36 U1.19
  Bottom Layer w0.254: 59.71,32.08 59.29,32.08 55.33,36.04 v1(55.33,48.36) ; 59.71,32.08 59.89,31.9 59.89,31.64 C29.2 ; 59.71,32.08 59.71,33.55 SW13.2
MISO: length 17.4
  Top Layer w0.254: U1.27 51.62,53.73 v1(52.06,54.17)
  Bottom Layer w0.254: v1(52.06,54.17) 54.78,56.89 54.78,66.3 U2.7
MOSI: length 19.2
  Top Layer w0.254: v1(51.39,54.58) 51.12,54.3 U1.28
  Bottom Layer w0.254: v1(51.39,54.58) 51.39,55.59 49.93,57.05 49.93,67.09 49.68,67.34 49.68,69.12 50.76,70.2 U2.6
NRST: length 23.7
  Top Layer w0.254: v1(37.55,32.55) 37.55,34 43.52,39.97 47.58,39.97 50.12,42.51 U1.7
  Bottom Layer w0.254: SW5.4 41.07,34.46 R33.2 39.15,32.55 v1(37.55,32.55)
OLED_SCL: length 22.9
  Top Layer w0.254: v1(42.5,52.42) 42.5,54.83 50.25,62.58 OLED1.3 ; U1.45 46.71,46.85 v1(46.95,47.09)
  Bottom Layer w0.254: v1(42.5,52.42) 46.95,47.97 v1(46.95,47.09)
OLED_SDA: length 25.9
  Top Layer w0.254: v1(43.39,52.67) 43.39,55.09 49.78,61.48 51.59,61.48 52.7,62.58 OLED1.4 ; U1.46 45.7,46.27 47.38,46.27 v1(47.45,46.2)
  Bottom Layer w0.254: v1(47.45,46.2) 47.53,46.27 47.53,47.89 43.39,52.03 v1(43.39,52.67)
PITCH: length 59.9
  Top Layer w0.254: v1(53.22,43.28) 53.19,43.28 U1.12
  Bottom Layer w0.254: v1(53.22,43.28) 53.42,43.07 53.42,39.85 50.88,37.31 16.49,37.31 SW15.2
ROLL: length 84.7
  Top Layer w0.203: SW15.(2) 17.61,55.69 17.61,32.48 23.32,26.77 41.03,26.77 42.25,27.98 42.25,28.67 49.49,35.91 54.57,35.91 57.36,38.7 57.36,43.4 55.41,45.35 U1.13
SCK: length 22.2
  Top Layer w0.254: U1.26 52.12,53.15 v1(52.79,53.82)
  Bottom Layer w0.254: v1(52.79,53.82) 55.14,56.17 55.14,67.79 53.74,69.18 52.15,69.18 U2.5
SCL: length 10
  Top Layer w0.203: U1.42 44.61,48.35 44.57,48.3 42.14,48.3 42.08,48.24 41.83,48.24 R34.1 40.56,48.24 38.57,48.24 37.76,49.05 36.47,49.05
SDA: length 10.1
  Top Layer w0.203: 36.47,47.15 36.5,47.13 36.79,47.13 37.5,47.84 40.56,47.84 R35.1 41.83,47.84 42.25,47.84 42.31,47.9 42.64,47.9 arc(42.65,47.89) 42.66,47.88 arc(42.66,47.87) 42.67,47.87 42.85,47.87 arc(42.86,47.87) 42.86,47.88 arc(42.87,47.89) 42.88,47.9 44.57,47.9 44.61,47.85 U1.43
SWCLK: length 37.6
  Top Layer w0.203: U1.37 44.02,52.44 44.02,54.58 45.93,56.48 50.63,56.48 58.63,64.48 70.34,64.48 71.04,65.18 71.04,65.21 71.96,66.14 U27.2
SWDIO: length 37.6
  Top Layer w0.203: U27.3 74.89,66.14 72.73,63.98 70.51,63.98 arc(70.43,63.95) 70.4,63.88 70.4,63.32 arc(70.3,63.21) 70.2,63.32 70.2,63.88 arc(70.1,63.98) 70,63.88 70,63.32 arc(69.9,63.21) 69.8,63.32 69.8,63.88 arc(69.69,63.98) 69.59,63.88 69.59,63.32 arc(69.49,63.21) 69.39,63.32 69.39,63.88 arc(69.29,63.98) 69.19,63.88 69.19,63.86 arc(69.08,63.76) 68.98,63.86 68.98,63.88 arc(68.95,63.95) 68.88,63.98 58.55,63.98 48.08,53.5 48.08,52.39 U1.34
THR: length 28
  Top Layer w0.203: U1.11 52.1,43.87 52.1,44.54 52.45,44.88 54.23,44.88 v1(55.96,43.15) ; v1(58.38,42.77) 59.01,42.77 63.19,46.94 72.71,46.94 SW14.2
  Bottom Layer w0.203: v1(58.38,42.77) 56.34,42.77 v1(55.96,43.15)
UART1_RX: length 32.4
  Top Layer w0.203: U1.31 49.62,54.17 v1(49.58,54.21)
  Bottom Layer w0.203: U26.2 24.95,66.14 28.51,62.58 41.21,62.58 v1(49.58,54.21)
UART1_TX: length 32.4
  Top Layer w0.203: U1.30 50.14,52.37 v1(50.14,54.77)
  Bottom Layer w0.203: U26.3 29.71,62.94 39.26,62.94 arc(39.33,62.97) 39.36,63.04 39.36,63.75 arc(39.46,63.85) 39.56,63.75 39.56,63.04 arc(39.59,62.97) 39.66,62.94 41.7,62.94 49.87,54.77 v1(50.14,54.77)
YAW: length 45.4
  Top Layer w0.203: v1(58.12,42.01) 59.26,42.01 63.76,46.5 72.67,46.5 73.17,46.01 76.86,46.01 85.22,54.37 SW14.(2) ; U1.10 51.62,43.15 52.08,42.69 55.53,42.69 v1(55.96,42.26)
  Bottom Layer w0.203: v1(55.96,42.26) 56.22,42.01 v1(58.12,42.01)
$1N642: length 2.8
  Top Layer w0.254: R1.1 44.31,47.35 U1.44
$1N784: length 3.2
  Top Layer w0.254: U1.20 54.2,48.94 55.08,48.94 55.53,48.94 55.84,49.24 R2.2
$1N1218: length 5.1
  Bottom Layer w0.254: BUZZER1.2 50.48,29.32 Q1.3
$1N8518: length 4.1
  Top Layer w0.381: LED11.2 90.12,22.87 R36.1
$1N8561: length 4.1
  Top Layer w0.381: R37.1 90.03,20.29 LED10.2
$1N8604: length 4
  Top Layer w0.381: R38.1 86.73,18.05 LED12.2

## Copper pours and planes (outline as drawn; the poured copper is in the pictures)
3V3 on Top Layer: 56.08,53.06 56.34,52.8 56.34,51.78 55.33,50.77 53.3,50.77 53.17,50.64 53.17,52.55 53.68,53.06
3V3 on Top Layer: 52.03,40.62 51.9,40.48 50.63,40.48 50.5,40.61 50.5,42.64 50.88,43.02 50.88,44.79 51.38,44.79 51.39,44.8 51.39,43.08 51.97,43.08 52.03,43.01
3V3 on Top Layer: 73.98,57.24 76.42,57.24 76.92,56.74 76.92,52.04 76.41,51.53 76.41,51.15 74.89,51.15 74.76,51.02 74,52.17 74,52.67 73.98,53.29
3V3 on Top Layer: 38.28,47.64 39.83,47.59 39.96,47.47 39.96,47.28 40.79,46.45 41.61,46.45 41.87,46.2 41.87,45.17 38.28,45.17
3V3 on Top Layer: 66.09,66.65 67.91,66.65 68.66,67.41 68.88,67.18 71.23,67.18 71.23,65.4 71.04,65.21 69,65.21 68.41,64.61 66.25,64.61 66.09,64.78
3V3 on Top Layer: 48.1,65.96 46.86,65.96 46.55,65.65 46.55,64.06 47.33,63.28 47.33,61.69 47.71,61.31 49.23,61.31 49.36,61.18 49.99,61.82 49.99,63.28 49.21,64.06 48.64,64.06 48.1,64.6
3V3 on Top Layer: 68.15,33.24 70.95,33.24 71.08,33.12 71.08,31.85 69.81,30.58 69.81,29.28 71.43,29.28 71.84,29.69 72.72,29.69 72.96,29.33 72.98,28.8 72.98,25.11 72.6,24.73 70.31,24.73 70.19,24.86 70.19,26.77 69.81,27.15 68.79,27.15 68.15,27.78
3V3 on Top Layer: 2.84,56.99 5.5,56.99 5.5,51.36 5.42,51.28 2.5,51.28 2.37,51.15 2.37,56.52
3V3 on Top Layer: 21.43,61.21 21.43,59.45 18.16,59.45 17.1,58.39 15.45,58.39 15.32,58.52 15.32,61.31 20.78,61.31 20.91,61.44 21.2,61.44
3V3 on Top Layer: 44.66,45.56 46.44,45.56 46.56,45.69 46.56,44.04 46.69,43.91 46.69,43.15 46.56,43.02 44.62,43.02 44.62,45.53
3V3 on Top Layer: 92.28,60.8 87.08,60.8 86.7,60.42 86.7,58.26 92.16,58.26 92.28,58.39
3V3 on Top Layer: 47.65,54.91 47.65,53.63 47.33,53.31 47.33,51.44 46.54,51.44 46.2,51.78 46.06,51.78 46.06,54.91
3V3 on Top Layer: 42.15,71.38 46.66,71.38 46.82,71.22 46.82,69.36 42.3,69.36 41.99,69.06 41.99,71.22
3V3 on Inner1: 62.63,27.4 56.83,27.4 54.69,24.61 48.6,24.61 47.58,25.62 47.58,27.91 44.91,27.91 44.91,42.97 47.28,40.61 52.25,40.61 52.25,42.24 52.03,42.46 50.94,42.46 50.5,42.9 46.68,42.9 46.56,43.02 46.57,43.02 46.55,44.43 46.18,44.8 44.58,44.8 44.58,44.34 43.79,43.55 41.91,43.55 41.91,49.16 46.18,52.68 47.45,53.31 49.83,56.58 52.39,55.78 54.06,54.11 54.06,51.41 56.28,51.41 63.7,58.82 63.7,60.97 65.18,62.45 71.33,62.45 73.92,59.86 73.92,56.05 74.51,55.47 76.16,55.47 76.54,55.85 76.54,56.74 81.36,61.57 90,61.57 90.38,61.18 90.38,59.49 91.04,58.83 92.44,58.83 92.44,63.19 92.03,63.6 73.11,63.6 71.44,65.27 68.16,65.27 68.16,66.65 67.72,66.65 66.35,66.49 55.58,55.47 55.14,56.17 45.74,60.98 44.62,62.52 45.3,64.23 45.42,64.36 47.92,64.36 47.92,65.85 46.74,67.03 44.53,67.03 44.53,68.99 44.3,68.99 44.21,69.1 43.83,69.79 43.96,71.45 42.12,71.6 41.96,69.54 42.25,66.65 42.63,64.84 42.63,63.85 43.08,62.45 43.64,59.53 48.6,57.37 46.99,54.91 45.92,54.91 45.92,53.86 45.65,53.59 44.62,53.59 44.62,53.21 42.43,51.01 40.49,51.01 40.45,50.98 40.45,44.44 40.47,44.42 40.47,42.9 41.1,42.26 42.63,42.26 43.65,41.24 43.65,32.49 42.88,31.72 38.82,31.72 38.66,31.57 38.66,30.06 41.12,30.06 42.63,28.55 41.36,27.28 34.35,27.28 28.79,30.7 5.85,57.02 12.21,63.06 19.53,63.06 19.79,62.8 19.79,59.89 20.02,59.66 21.35,59.66 21.43,59.73 21.43,61.51 21.67,61.76 21.67,63.34 22.82,64.49 22.82,67.78 22.72,67.88 20.36,67.88 18.75,66.26 18.75,65.76 17.97,64.97 9.08,64.97 2.5,58.39 2.5,55.55 2.96,55.09 5.54,55.09 8.17,51.91 8.17,51.52 9.05,50.51 17.36,40.86 28.02,25.5 35.52,25.12 38.06,25.5 42.76,21.56 47.33,21.18 47.58,21.43 56.22,21.43 58,23.21 58.25,23.21 60.92,25.88 66.89,25.5 69.81,24.1 73.13,24.1 73.04,27.59 73.11,27.66 62.89,27.66
3V3ZHUAN5 on Top Layer: 93.43,35.66 91.9,35.66 91.78,35.78 91.78,33.67 90.33,32.23 90.13,32.23 90.13,29.05 90,28.92 90,27.65 90.25,27.4 94.95,27.4 94.95,35.23 94.39,35.8 93.57,35.8
3V3ZHUAN5 on Inner1: 97.66,36.97 97.62,36.93 92.67,36.93 91.78,36.04 91.78,33.71 93.47,33.71 93.55,33.75 94.95,35.02 97.75,35.02 97.87,35.15 97.87,36.76
5V on Top Layer: 73.74,35.01 74.59,35.01 74.61,35.63 79.43,35.63 80.09,36.29 80.09,37.81 80.35,38.07 83.52,38.07 84.79,36.8 84.79,34.2 82.79,34.2 82.79,35.78 82.27,35.87 81.86,35.87 81.86,33.77 75.39,33.75 75.23,33.67 74.89,33.5 74.78,33.37 72.73,31.59 72.73,30.94 71.84,30.94 71.84,32.23 71.83,32.24 72.73,33.14 72.73,33.37 73.76,33.37 73.74,34.07
GND on Top Layer: -21.89,78.58 121.88,78.58 130,70.45 130,8.6 95.84,-25.56 -54.02,-25.56 -21.89,6.57
GND on Bottom Layer: -50.84,94.08 113.75,94.08 142.45,65.37 142.45,-7.65 115.78,-34.32 9.1,-34.32 -50.84,25.62
GND on Inner2: -46.02,91.15 131.27,91.15 150.2,72.23 150.2,7.46 95.21,-47.53 -37.26,-47.53 -46.02,-38.77
VBAT on Top Layer: 95.21,30.07 95.21,27.27 95.33,27.15 94.53,26.34 94.95,23.46 94.57,20.16 93.68,19.27 91.78,19.27 91.65,19.15 91.65,16.99 91.52,16.86 98.04,16.86 100.92,30.19 101.05,30.32 95.46,30.32
VBAT on Inner1: 95.27,29.71 95.27,27.21 95.33,27.15 97.95,27.15 97.95,28.11 99.78,29.94 99.78,34.83 95.13,34.83 95.13,33.29 94.95,33.12 98,33.12 98.13,32.99 98.13,31.08 96.75,29.71
$1N2158 on Top Layer: 88.6,27.65 88.35,27.4 85.81,27.4 85.3,27.91 85.3,30.15 83.41,30.15 83.41,31.32 83.39,31.34 83.39,32.99 83.65,33.24 84.66,33.24 84.72,32.26 84.72,31.48 88.6,31.48
$1N2242 on Top Layer: 85.06,29.8 85.17,29.69 85.17,28.19 81.89,28.19 81.87,28.16 81.87,29.8
$1N2893 on Top Layer: 72.73,33.5 68.41,33.5 68.28,33.62 68.28,35.11 72.64,35.11 72.73,35.02
$1N2894 on Top Layer: 74.64,32.27 74.64,29.54 72.75,29.54 72.6,29.69 71.58,29.69 71.46,29.56 69.94,29.56 69.94,30.59 70.06,30.7 72.84,30.7 72.84,31.36 73.84,32.35 74.56,32.35

Small or netless copper shapes (teardrops, artwork), in the pictures only: 55 on Top Layer, 46 on Bottom Layer

## Text on the board
Top Silkscreen Layer: U1_RX | U1_TX | KEY1 | 3V3 | GND | KEY4 | KEY3 | RST | SCL | SDA | KEY8 | KEY7 | KE5 | KE6 | SLK | SDI | KEY2 | + | - | ROLL | THR | PITCH
